# EAGLE design xe-lvl (EAGLE 9.5.0)

## Sheet 1 of 4: BUS i/o
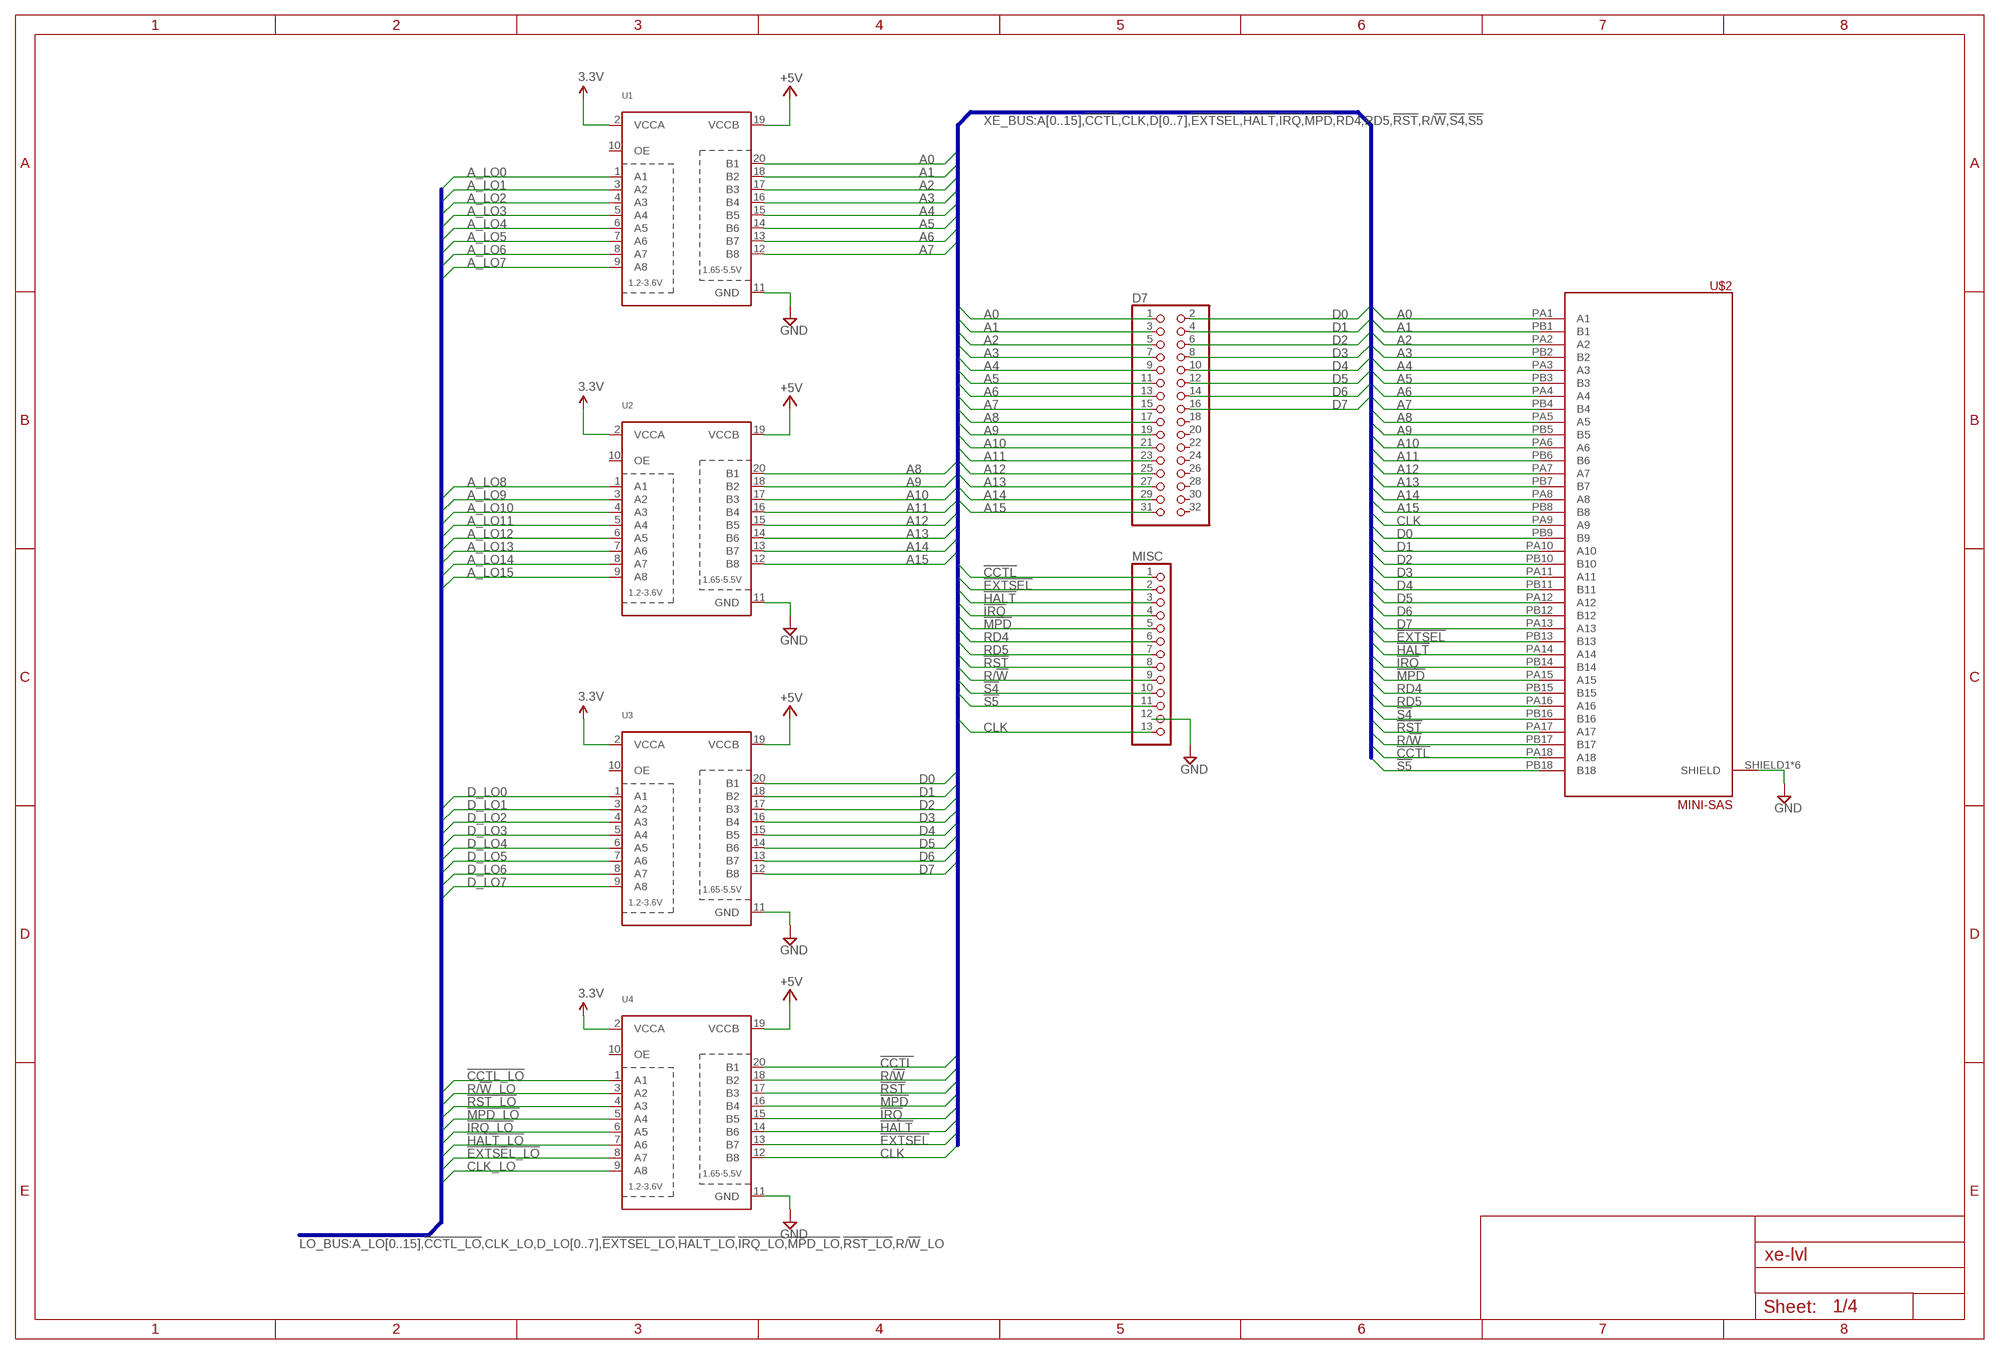
[diagram p0: schematic, sheet 1]

### Parts
D7  PINHD-2X16  [2X16]
MISC  PINHD-1X13  [1X13]
U1  TXB0108PWR  [TSSOP20]
U2  TXB0108PWR  [TSSOP20]
U3  TXB0108PWR  [TSSOP20]
U4  TXB0108PWR  [TSSOP20]
U$2  MINI-SAS  [MINI-SAS]

### Nets
3.3V: U1.2(VCCA) U2.2(VCCA) U3.2(VCCA) U4.2(VCCA) ; also sheet 4
!CCTL!: MISC.1 U4.20(B1) U$2.PA18(A18)
!CCTL_LO!: U4.1(A1)
!EXTSEL!: MISC.2 U4.13(B7) U$2.PB13(B13)
!EXTSEL_LO!: U4.8(A7)
!HALT!: MISC.3 U4.14(B6) U$2.PA14(A14)
!HALT_LO!: U4.7(A6)
!IRQ!: MISC.4 U4.15(B5) U$2.PB14(B14)
!IRQ_LO!: U4.6(A5)
!MPD!: MISC.5 U4.16(B4) U$2.PA15(A15)
!MPD_LO!: U4.5(A4)
!RST!: MISC.8 U4.17(B3) U$2.PA17(A17) ; also sheet 4
!RST_LO!: U4.4(A3)
!S4!: MISC.10 U$2.PB16(B16)
!S5!: MISC.11 U$2.PB18(B18)
+5V: U1.19(VCCB) U2.19(VCCB) U3.19(VCCB) U4.19(VCCB) ; also sheet 4
A0: D7.1 U1.20(B1) U$2.PA1(A1)
A1: D7.3 U1.18(B2) U$2.PB1(B1)
A2: D7.5 U1.17(B3) U$2.PA2(A2)
A3: D7.7 U1.16(B4) U$2.PB2(B2)
A4: D7.9 U1.15(B5) U$2.PA3(A3)
A5: D7.11 U1.14(B6) U$2.PB3(B3)
A6: D7.13 U1.13(B7) U$2.PA4(A4)
A7: D7.15 U1.12(B8) U$2.PB4(B4)
A8: D7.17 U2.20(B1) U$2.PA5(A5)
A9: D7.19 U2.18(B2) U$2.PB5(B5)
A10: D7.21 U2.17(B3) U$2.PA6(A6)
A11: D7.23 U2.16(B4) U$2.PB6(B6)
A12: D7.25 U2.15(B5) U$2.PA7(A7)
A13: D7.27 U2.14(B6) U$2.PB7(B7)
A14: D7.29 U2.13(B7) U$2.PA8(A8)
A15: D7.31 U2.12(B8) U$2.PB8(B8)
A_LO0: U1.1(A1)
A_LO1: U1.3(A2)
A_LO2: U1.4(A3)
A_LO3: U1.5(A4)
A_LO4: U1.6(A5)
A_LO5: U1.7(A6)
A_LO6: U1.8(A7)
A_LO7: U1.9(A8)
A_LO8: U2.1(A1)
A_LO9: U2.3(A2)
A_LO10: U2.4(A3)
A_LO11: U2.5(A4)
A_LO12: U2.6(A5)
A_LO13: U2.7(A6)
A_LO14: U2.8(A7)
A_LO15: U2.9(A8)
CLK: MISC.13 U4.12(B8) U$2.PA9(A9)
CLK_LO: U4.9(A8)
D0: D7.2 U3.20(B1) U$2.PB9(B9)
D1: D7.4 U3.18(B2) U$2.PA10(A10)
D2: D7.6 U3.17(B3) U$2.PB10(B10)
D3: D7.8 U3.16(B4) U$2.PA11(A11)
D4: D7.10 U3.15(B5) U$2.PB11(B11)
D5: D7.12 U3.14(B6) U$2.PA12(A12)
D6: D7.14 U3.13(B7) U$2.PB12(B12)
D7: D7.16 U3.12(B8) U$2.PA13(A13)
D_LO0: U3.1(A1)
D_LO1: U3.3(A2)
D_LO2: U3.4(A3)
D_LO3: U3.5(A4)
D_LO4: U3.6(A5)
D_LO5: U3.7(A6)
D_LO6: U3.8(A7)
D_LO7: U3.9(A8)
GND: MISC.12 U1.11(GND) U2.11(GND) U3.11(GND) U4.11(GND) U$2.SHIELD1(SHIELD) U$2.SHIELD2(SHIELD) U$2.SHIELD3(SHIELD) U$2.SHIELD4(SHIELD) U$2.SHIELD5(SHIELD) U$2.SHIELD6(SHIELD) ; also sheet 3,4
R/!W!: MISC.9 U4.18(B2) U$2.PB17(B17)
R/!W!_LO: U4.3(A2)
RD4: MISC.6 U$2.PB15(B15)
RD5: MISC.7 U$2.PA16(A16)
Unconnected: D7.18 D7.20 D7.22 D7.24 D7.26 D7.28 D7.30 D7.32 U1.10(OE) U2.10(OE) U3.10(OE) U4.10(OE)

### Buses
XE_BUS:A[0..15],!CCTL!,CLK,D[0..7],!EXTSEL!,!HALT!,!IRQ!,!MPD!,RD4,RD5,!RST!,R/!W!,!S4!,!S5!
LO_BUS:A_LO[0..15],!CCTL_LO!,CLK_LO,D_LO[0..7],!EXTSEL_LO!,!HALT_LO!,!IRQ_LO!,!MPD_LO!,!RST_LO!,R/!W!_LO

## Sheet 2 of 4
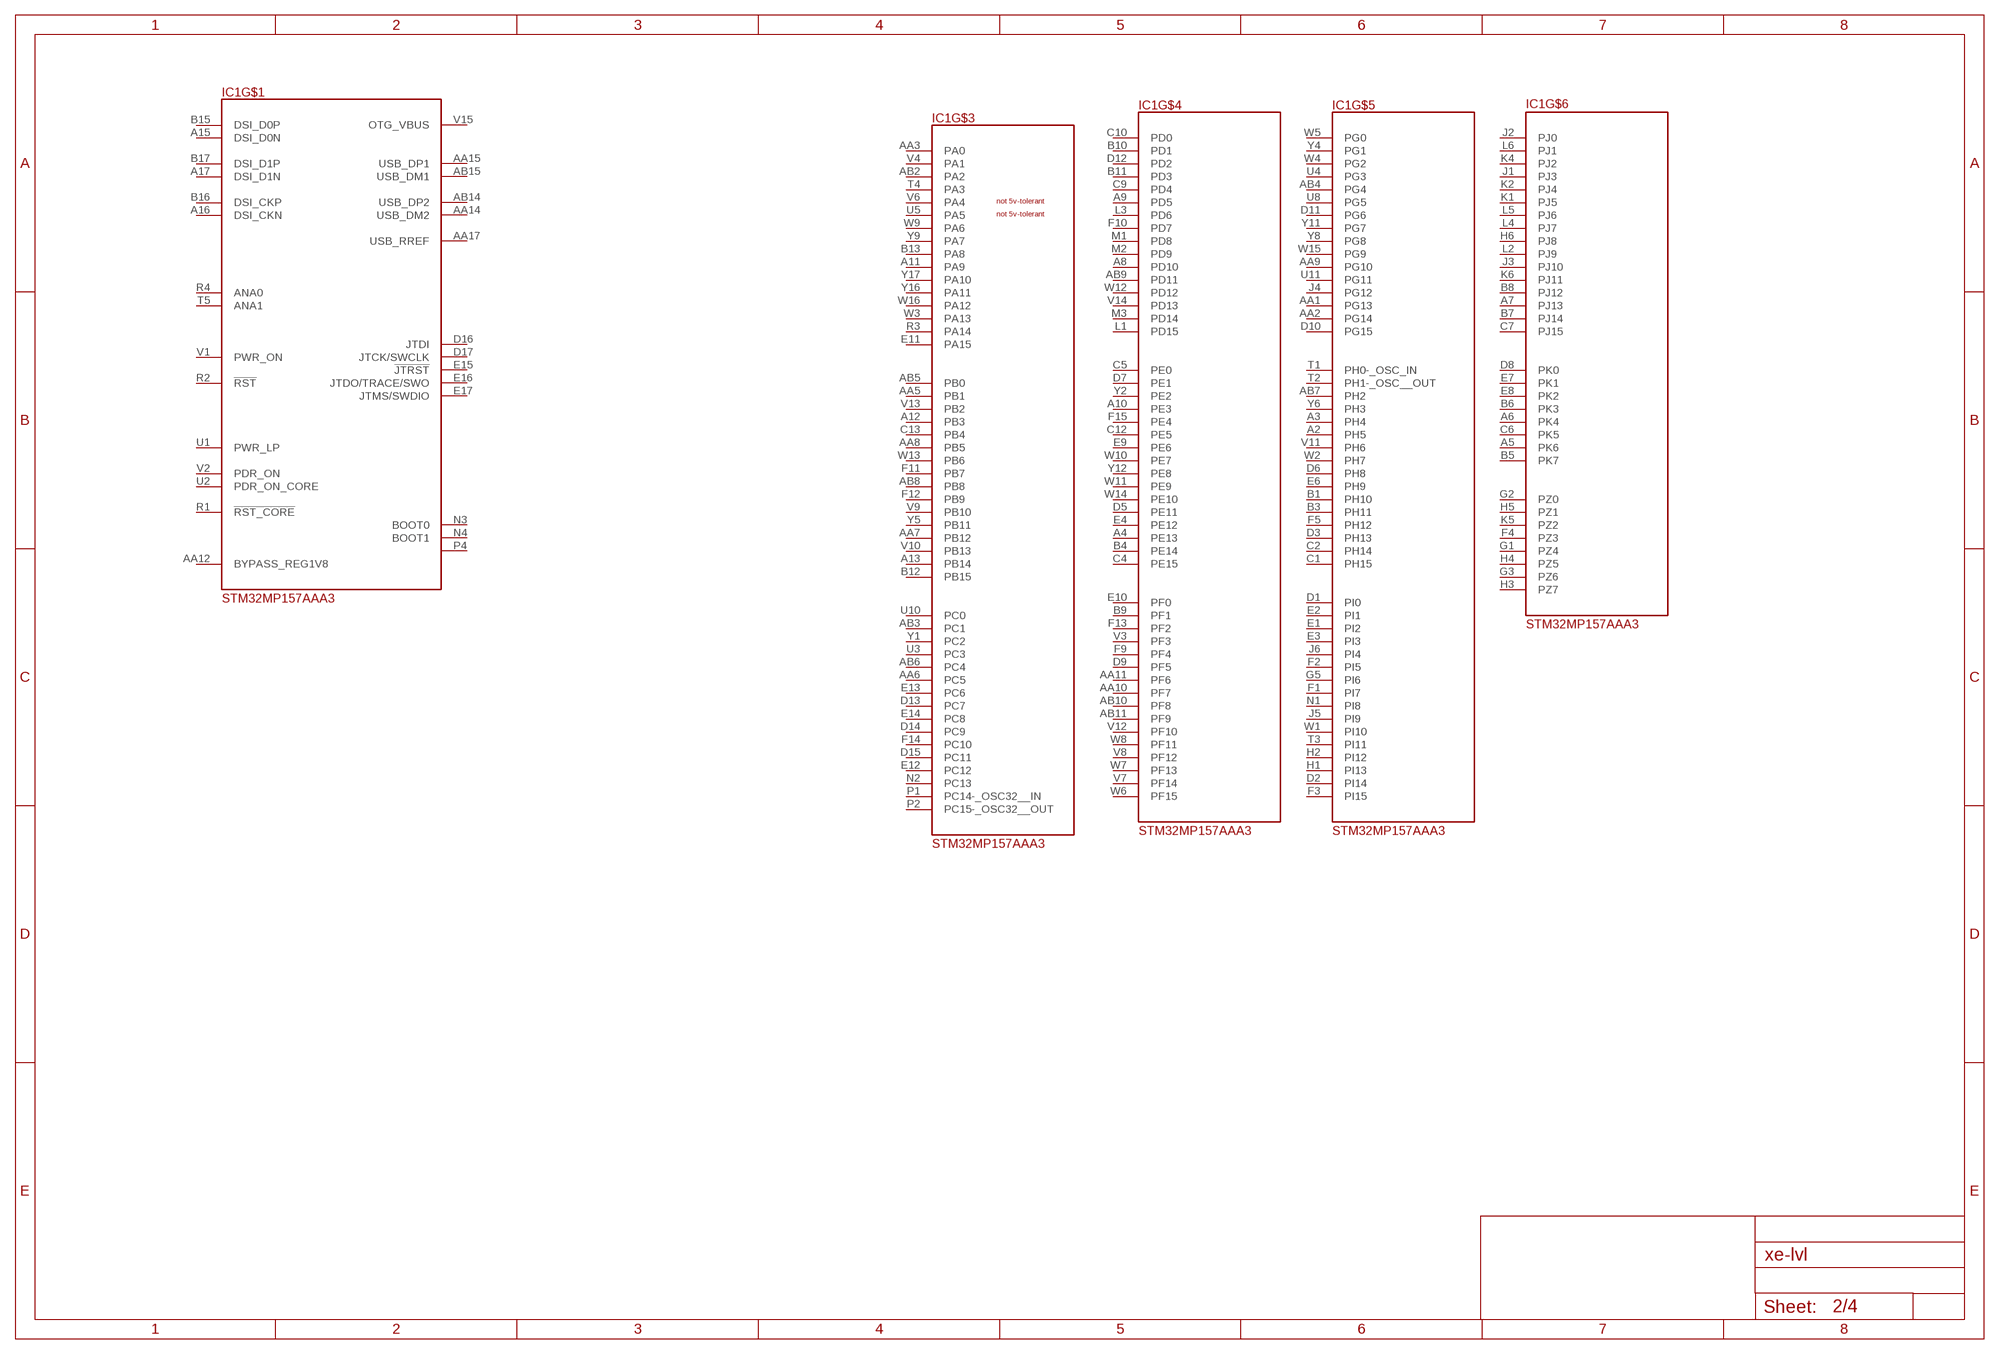
[diagram p1: schematic, sheet 2]

### Parts
IC1  STM32MP157AAA3  [BGA448C80P22X22_1800X1800X127]
Unconnected: IC1.A2(PH5) IC1.A3(PH4) IC1.A4(PE13) IC1.A5(PK6) IC1.A6(PK4) IC1.A7(PJ13) IC1.A8(PD10) IC1.A9(PD5) IC1.A10(PE3) IC1.A11(PA9) IC1.A12(PB3) IC1.A13(PB14) IC1.A15(DSI_D0N) IC1.A16(DSI_CKN) IC1.A17(DSI_D1N) IC1.AA1(PG13) IC1.AA2(PG14) IC1.AA3(PA0) IC1.AA5(PB1) IC1.AA6(PC5) IC1.AA7(PB12) IC1.AA8(PB5) IC1.AA9(PG10) IC1.AA10(PF7) IC1.AA11(PF6) IC1.AA12(BYPASS_REG1V8) IC1.AA14(USB_DM2) IC1.AA15(USB_DP1) IC1.AA17(USB_RREF) IC1.AB2(PA2) IC1.AB3(PC1) IC1.AB4(PG4) IC1.AB5(PB0) IC1.AB6(PC4) IC1.AB7(PH2) IC1.AB8(PB8) IC1.AB9(PD11) IC1.AB10(PF8) IC1.AB11(PF9) IC1.AB14(USB_DP2) IC1.AB15(USB_DM1) IC1.B1(PH10) IC1.B3(PH11) IC1.B4(PE14) IC1.B5(PK7) IC1.B6(PK3) IC1.B7(PJ14) IC1.B8(PJ12) IC1.B9(PF1) IC1.B10(PD1) IC1.B11(PD3) IC1.B12(PB15) IC1.B13(PA8) IC1.B15(DSI_D0P) IC1.B16(DSI_CKP) IC1.B17(DSI_D1P) IC1.C1(PH15) IC1.C2(PH14) IC1.C4(PE15) IC1.C5(PE0) IC1.C6(PK5) IC1.C7(PJ15) IC1.C9(PD4) IC1.C10(PD0) IC1.C12(PE5) IC1.C13(PB4) IC1.D1(PI0) IC1.D2(PI14) IC1.D3(PH13) IC1.D5(PE11) IC1.D6(PH8) IC1.D7(PE1) IC1.D8(PK0) IC1.D9(PF5) IC1.D10(PG15) IC1.D11(PG6) IC1.D12(PD2) IC1.D13(PC7) IC1.D14(PC9) IC1.D15(PC11) IC1.D16(JTDI) IC1.D17(JTCK/SWCLK) IC1.E1(PI2) IC1.E2(PI1) IC1.E3(PI3) IC1.E4(PE12) IC1.E6(PH9) IC1.E7(PK1) IC1.E8(PK2) IC1.E9(PE6) IC1.E10(PF0) IC1.E11(PA15) IC1.E12(PC12) IC1.E13(PC6) IC1.E14(PC8) IC1.E15(!JTRST) IC1.E16(JTDO/TRACE/SWO) IC1.E17(JTMS/SWDIO) IC1.F1(PI7) IC1.F2(PI5) IC1.F3(PI15) IC1.F4(PZ3) IC1.F5(PH12) IC1.F9(PF4) IC1.F10(PD7) IC1.F11(PB7) IC1.F12(PB9) IC1.F13(PF2) IC1.F14(PC10) IC1.F15(PE4) IC1.G1(PZ4) IC1.G2(PZ0) IC1.G3(PZ6) IC1.G5(PI6) IC1.H1(PI13) IC1.H2(PI12) IC1.H3(PZ7) IC1.H4(PZ5) IC1.H5(PZ1) IC1.H6(PJ8) IC1.J1(PJ3) IC1.J2(PJ0) IC1.J3(PJ10) IC1.J4(PG12) IC1.J5(PI9) IC1.J6(PI4) IC1.K1(PJ5) IC1.K2(PJ4) IC1.K4(PJ2) IC1.K5(PZ2) IC1.K6(PJ11) IC1.L1(PD15) IC1.L2(PJ9) IC1.L3(PD6) IC1.L4(PJ7) IC1.L5(PJ6) IC1.L6(PJ1) IC1.M1(PD8) IC1.M2(PD9) IC1.M3(PD14) IC1.N1(PI8) IC1.N2(PC13) IC1.N3(BOOT0) IC1.N4(BOOT1) IC1.P1(PC14-_OSC32__IN) IC1.P2(PC15-_OSC32__OUT) IC1.P4 IC1.R1(!RST_CORE!) IC1.R2(!RST!) IC1.R3(PA14) IC1.R4(ANA0) IC1.T1(PH0-_OSC_IN) IC1.T2(PH1-_OSC__OUT) IC1.T3(PI11) IC1.T4(PA3) IC1.T5(ANA1) IC1.U1(PWR_LP) IC1.U2(PDR_ON_CORE) IC1.U3(PC3) IC1.U4(PG3) IC1.U5(PA5) IC1.U8(PG5) IC1.U10(PC0) IC1.U11(PG11) IC1.V1(PWR_ON) IC1.V2(PDR_ON) IC1.V3(PF3) IC1.V4(PA1) IC1.V6(PA4) IC1.V7(PF14) IC1.V8(PF12) IC1.V9(PB10) IC1.V10(PB13) IC1.V11(PH6) IC1.V12(PF10) IC1.V13(PB2) IC1.V14(PD13) IC1.V15(OTG_VBUS) IC1.W1(PI10) IC1.W2(PH7) IC1.W3(PA13) IC1.W4(PG2) IC1.W5(PG0) IC1.W6(PF15) IC1.W7(PF13) IC1.W8(PF11) IC1.W9(PA6) IC1.W10(PE7) IC1.W11(PE9) IC1.W12(PD12) IC1.W13(PB6) IC1.W14(PE10) IC1.W15(PG9) IC1.W16(PA12) IC1.Y1(PC2) IC1.Y2(PE2) IC1.Y4(PG1) IC1.Y5(PB11) IC1.Y6(PH3) IC1.Y8(PG8) IC1.Y9(PA7) IC1.Y11(PG7) IC1.Y12(PE8) IC1.Y16(PA11) IC1.Y17(PA10)

## Sheet 3 of 4: Memory
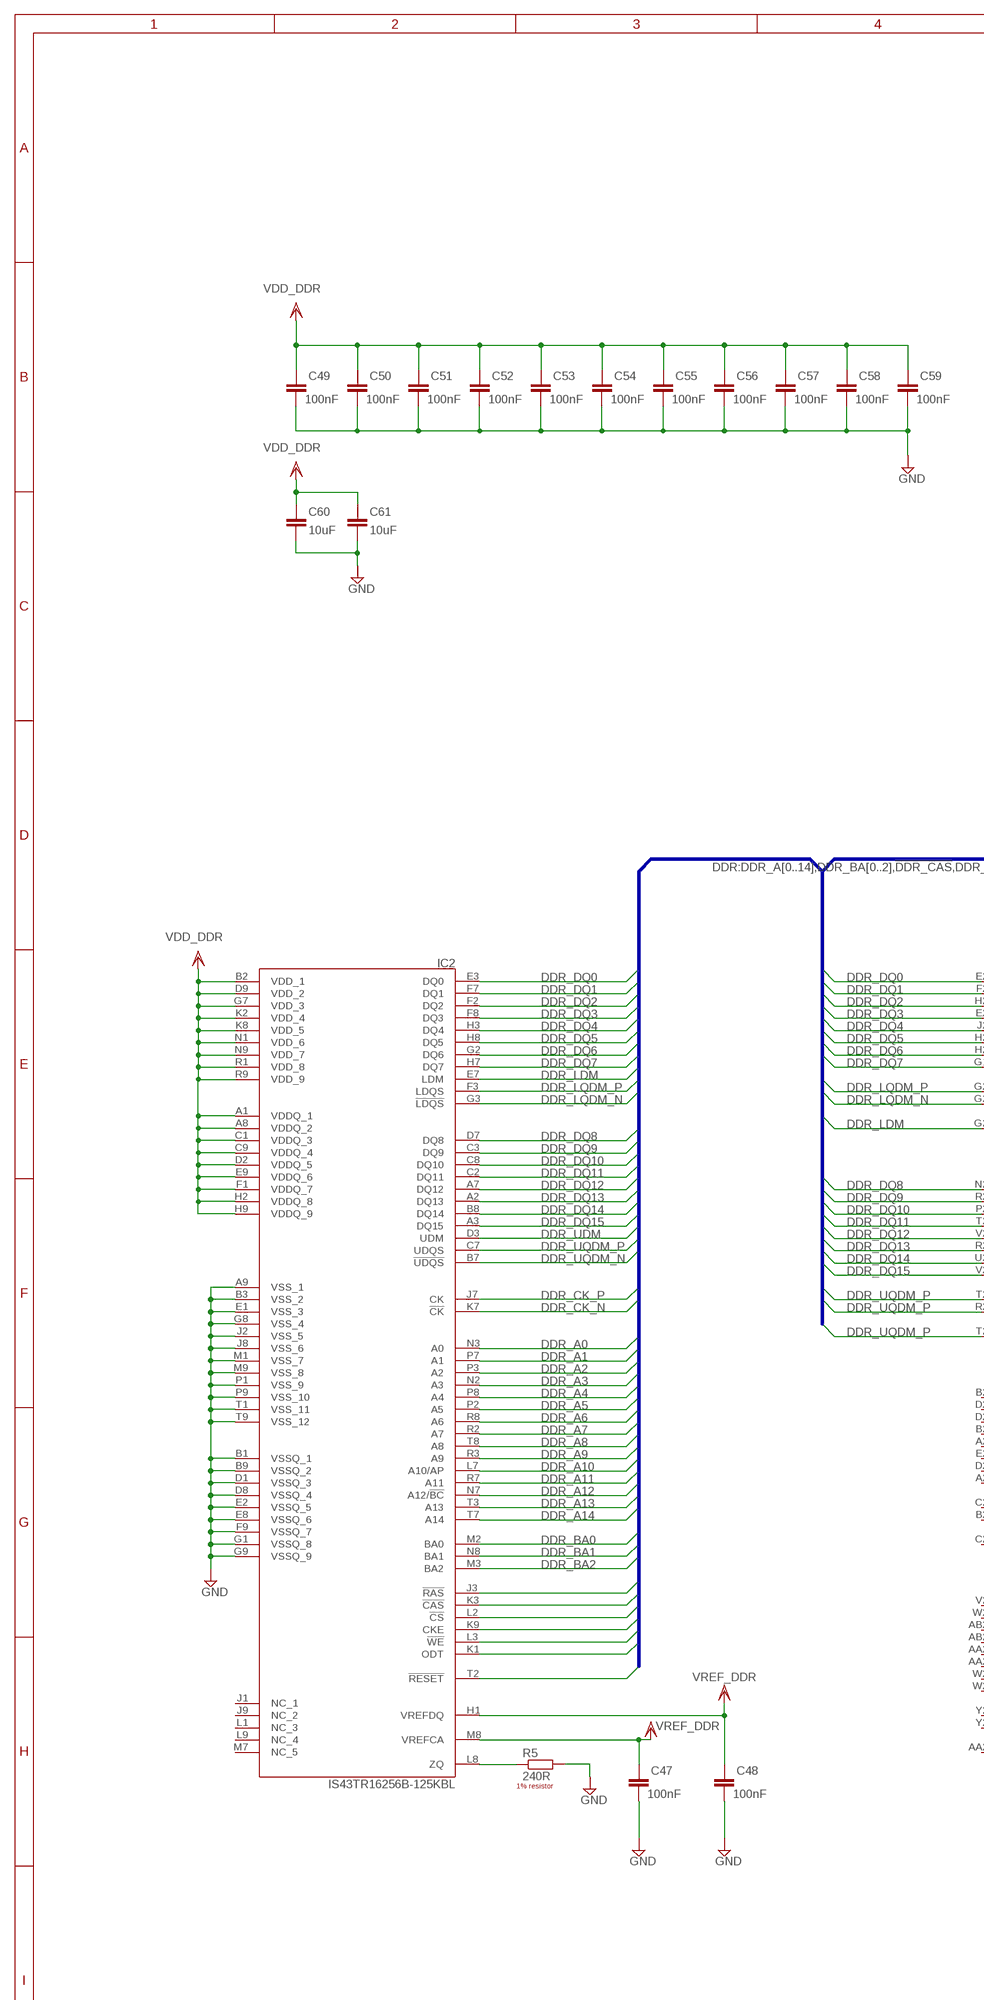
[diagram p2: schematic, sheet 3, part 1 of 2]
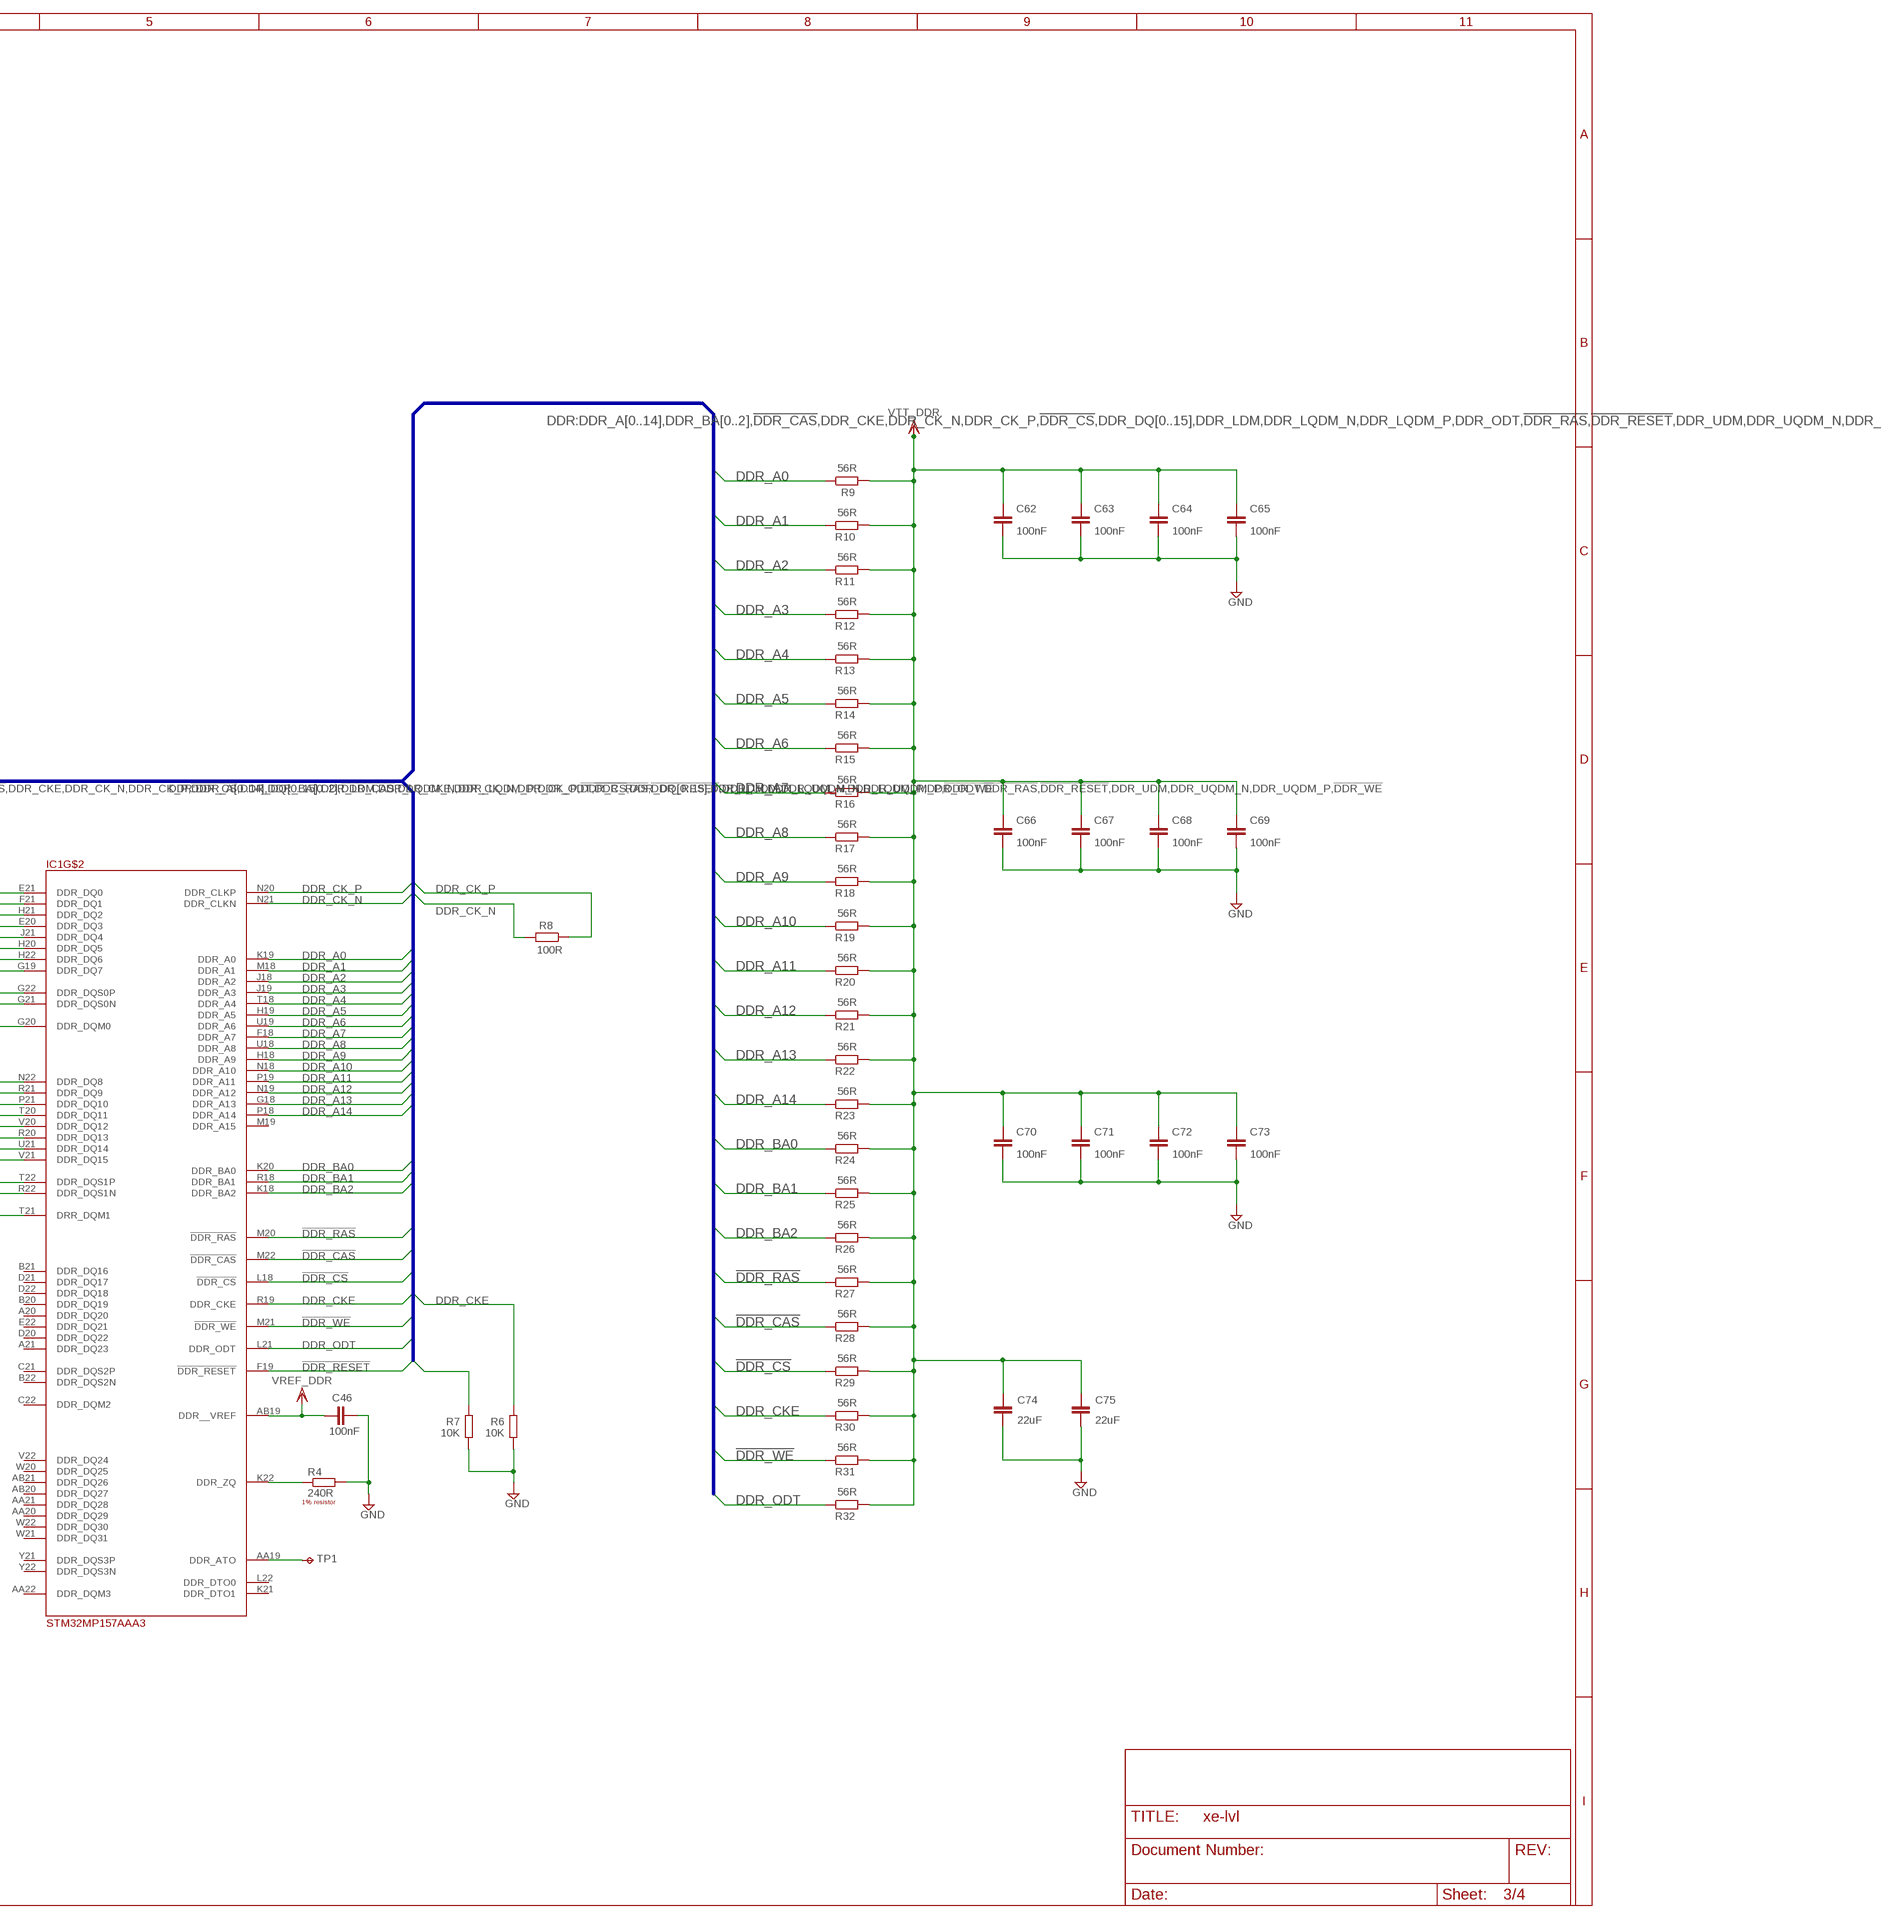
[diagram p3: schematic, sheet 3, part 2 of 2]

### Parts
C46  100nF  C-EUC0201  [C0201]
C47  100nF  C-EUC0201  [C0201]
C48  100nF  C-EUC0201  [C0201]
C49  100nF  C-EUC0201  [C0201]
C50  100nF  C-EUC0201  [C0201]
C51  100nF  C-EUC0201  [C0201]
C52  100nF  C-EUC0201  [C0201]
C53  100nF  C-EUC0201  [C0201]
C54  100nF  C-EUC0201  [C0201]
C55  100nF  C-EUC0201  [C0201]
C56  100nF  C-EUC0201  [C0201]
C57  100nF  C-EUC0201  [C0201]
C58  100nF  C-EUC0201  [C0201]
C59  100nF  C-EUC0201  [C0201]
C60  10uF  C-EUC0402  [C0402]
C61  10uF  C-EUC0402  [C0402]
C62  100nF  C-EUC0201  [C0201]
C63  100nF  C-EUC0201  [C0201]
C64  100nF  C-EUC0201  [C0201]
C65  100nF  C-EUC0201  [C0201]
C66  100nF  C-EUC0201  [C0201]
C67  100nF  C-EUC0201  [C0201]
C68  100nF  C-EUC0201  [C0201]
C69  100nF  C-EUC0201  [C0201]
C70  100nF  C-EUC0201  [C0201]
C71  100nF  C-EUC0201  [C0201]
C72  100nF  C-EUC0201  [C0201]
C73  100nF  C-EUC0201  [C0201]
C74  22uF  C-EUC0402  [C0402]
C75  22uF  C-EUC0402  [C0402]
IC2  IS43TR16256B-125KBL  MT41K256M16TW-107_P  [BGA96C80P9X16_800X1400X120]
R4  240R  R-EU_R0201  [R0201]
R5  240R  R-EU_R0201  [R0201]
R6  10K  R-EU_R0201  [R0201]
R7  10K  R-EU_R0201  [R0201]
R8  100R  R-EU_R0201  [R0201]
R9  56R  R-EU_R0201  [R0201]
R10  56R  R-EU_R0201  [R0201]
R11  56R  R-EU_R0201  [R0201]
R12  56R  R-EU_R0201  [R0201]
R13  56R  R-EU_R0201  [R0201]
R14  56R  R-EU_R0201  [R0201]
R15  56R  R-EU_R0201  [R0201]
R16  56R  R-EU_R0201  [R0201]
R17  56R  R-EU_R0201  [R0201]
R18  56R  R-EU_R0201  [R0201]
R19  56R  R-EU_R0201  [R0201]
R20  56R  R-EU_R0201  [R0201]
R21  56R  R-EU_R0201  [R0201]
R22  56R  R-EU_R0201  [R0201]
R23  56R  R-EU_R0201  [R0201]
R24  56R  R-EU_R0201  [R0201]
R25  56R  R-EU_R0201  [R0201]
R26  56R  R-EU_R0201  [R0201]
R27  56R  R-EU_R0201  [R0201]
R28  56R  R-EU_R0201  [R0201]
R29  56R  R-EU_R0201  [R0201]
R30  56R  R-EU_R0201  [R0201]
R31  56R  R-EU_R0201  [R0201]
R32  56R  R-EU_R0201  [R0201]
TP1  TPB1,27  [B1,27]

### Nets
!DDR_CAS! [DDR_CTRL]: IC1.M22(!DDR_CAS!) IC2.K3(!CAS!) R28.1
!DDR_CS! [DDR_CTRL]: IC1.L18(!DDR_CS!) IC2.L2(!CS!) R29.1
!DDR_RAS! [DDR_CTRL]: IC1.M20(!DDR_RAS!) IC2.J3(!RAS!) R27.1
!DDR_RESET!: IC1.F19(!DDR_RESET!) IC2.T2(!RESET!) R7.2
!DDR_WE! [DDR_CTRL]: IC1.M21(!DDR_WE!) IC2.L3(!WE!) R31.1
DDR_A0 [DDR_CTRL]: IC1.K19(DDR_A0) IC2.N3(A0) R9.1
DDR_A1 [DDR_CTRL]: IC1.M18(DDR_A1) IC2.P7(A1) R10.1
DDR_A2 [DDR_CTRL]: IC1.J18(DDR_A2) IC2.P3(A2) R11.1
DDR_A3 [DDR_CTRL]: IC1.J19(DDR_A3) IC2.N2(A3) R12.1
DDR_A4 [DDR_CTRL]: IC1.T18(DDR_A4) IC2.P8(A4) R13.1
DDR_A5 [DDR_CTRL]: IC1.H19(DDR_A5) IC2.P2(A5) R14.1
DDR_A6 [DDR_CTRL]: IC1.U19(DDR_A6) IC2.R8(A6) R15.1
DDR_A7 [DDR_CTRL]: IC1.F18(DDR_A7) IC2.R2(A7) R16.1
DDR_A8 [DDR_CTRL]: IC1.U18(DDR_A8) IC2.T8(A8) R17.1
DDR_A9 [DDR_CTRL]: IC1.H18(DDR_A9) IC2.R3(A9) R18.1
DDR_A10 [DDR_CTRL]: IC1.N18(DDR_A10) IC2.L7(A10/AP) R19.1
DDR_A11 [DDR_CTRL]: IC1.P19(DDR_A11) IC2.R7(A11) R20.1
DDR_A12 [DDR_CTRL]: IC1.N19(DDR_A12) IC2.N7(A12/!BC!) R21.1
DDR_A13 [DDR_CTRL]: IC1.G18(DDR_A13) IC2.T3(A13) R22.1
DDR_A14 [DDR_CTRL]: IC1.P18(DDR_A14) IC2.T7(A14) R23.1
DDR_BA0 [DDR_CTRL]: IC1.K20(DDR_BA0) IC2.M2(BA0) R24.1
DDR_BA1 [DDR_CTRL]: IC1.R18(DDR_BA1) IC2.N8(BA1) R25.1
DDR_BA2 [DDR_CTRL]: IC1.K18(DDR_BA2) IC2.M3(BA2) R26.1
DDR_CK_N [DDR_CK]: IC1.N21(DDR_CLKN) IC2.K7(!CK!) R8.2
DDR_CK_P [DDR_CK]: IC1.N20(DDR_CLKP) IC2.J7(CK) R8.1
DDR_CKE [DDR_CTRL]: IC1.R19(DDR_CKE) IC2.K9(CKE) R6.2 R30.1
DDR_DQ0 [DDR_DQ]: IC1.E21(DDR_DQ0) IC2.E3(DQ0)
DDR_DQ1 [DDR_DQ]: IC1.F21(DDR_DQ1) IC2.F7(DQ1)
DDR_DQ2 [DDR_DQ]: IC1.H21(DDR_DQ2) IC2.F2(DQ2)
DDR_DQ3 [DDR_DQ]: IC1.E20(DDR_DQ3) IC2.F8(DQ3)
DDR_DQ4 [DDR_DQ]: IC1.J21(DDR_DQ4) IC2.H3(DQ4)
DDR_DQ5 [DDR_DQ]: IC1.H20(DDR_DQ5) IC2.H8(DQ5)
DDR_DQ6 [DDR_DQ]: IC1.H22(DDR_DQ6) IC2.G2(DQ6)
DDR_DQ7 [DDR_DQ]: IC1.G19(DDR_DQ7) IC2.H7(DQ7)
DDR_DQ8 [DDR_DQ]: IC1.N22(DDR_DQ8) IC2.D7(DQ8)
DDR_DQ9 [DDR_DQ]: IC1.R21(DDR_DQ9) IC2.C3(DQ9)
DDR_DQ10 [DDR_DQ]: IC1.P21(DDR_DQ10) IC2.C8(DQ10)
DDR_DQ11 [DDR_DQ]: IC1.T20(DDR_DQ11) IC2.C2(DQ11)
DDR_DQ12 [DDR_DQ]: IC1.V20(DDR_DQ12) IC2.A7(DQ12)
DDR_DQ13 [DDR_DQ]: IC1.R20(DDR_DQ13) IC2.A2(DQ13)
DDR_DQ14 [DDR_DQ]: IC1.U21(DDR_DQ14) IC2.B8(DQ14)
DDR_DQ15 [DDR_DQ]: IC1.V21(DDR_DQ15) IC2.A3(DQ15)
DDR_LDM [DDR_DQ]: IC1.G20(DDR_DQM0) IC2.E7(LDM)
DDR_LQDM_N [DDR_DQ]: IC1.G21(DDR_DQS0N) IC2.G3(!LDQS!)
DDR_LQDM_P [DDR_DQ]: IC1.G22(DDR_DQS0P) IC2.F3(LDQS)
DDR_ODT [DDR_CTRL]: IC1.L21(DDR_ODT) IC2.K1(ODT) R32.1
DDR_UDM [DDR_DQ]: IC1.T21(DRR_DQM1) IC2.D3(UDM)
DDR_UQDM_N [DDR_DQ]: IC1.R22(DDR_DQS1N) IC2.B7(!UDQS!)
DDR_UQDM_P [DDR_DQ]: IC1.T22(DDR_DQS1P) IC2.C7(UDQS)
GND: C46.2 C47.1 C48.1 C49.1 C50.1 C51.1 C52.1 C53.1 C54.1 C55.1 C56.1 C57.1 C58.1 C59.1 C60.2 C61.2 C62.1 C63.1 C64.1 C65.1 C66.1 C67.1 C68.1 C69.1 C70.1 C71.1 C72.1 C73.1 C74.1 C75.1 IC2.A9(VSS_1) IC2.B1(VSSQ_1) IC2.B3(VSS_2) IC2.B9(VSSQ_2) IC2.D1(VSSQ_3) IC2.D8(VSSQ_4) IC2.E1(VSS_3) IC2.E2(VSSQ_5) IC2.E8(VSSQ_6) IC2.F9(VSSQ_7) IC2.G1(VSSQ_8) IC2.G8(VSS_4) IC2.G9(VSSQ_9) IC2.J2(VSS_5) IC2.J8(VSS_6) IC2.M1(VSS_7) IC2.M9(VSS_8) IC2.P1(VSS_9) IC2.P9(VSS_10) IC2.T1(VSS_11) IC2.T9(VSS_12) R4.2 R5.2 R6.1 R7.1 ; also sheet 1,4
N$15: IC1.K22(DDR_ZQ) R4.1
N$16: IC1.AA19(DDR_ATO) TP1.TP
N$17: IC2.L8(ZQ) R5.1
VDD_DDR: C49.2 C50.2 C51.2 C52.2 C53.2 C54.2 C55.2 C56.2 C57.2 C58.2 C59.2 C60.1 C61.1 IC2.A1(VDDQ_1) IC2.A8(VDDQ_2) IC2.B2(VDD_1) IC2.C1(VDDQ_3) IC2.C9(VDDQ_4) IC2.D2(VDDQ_5) IC2.D9(VDD_2) IC2.E9(VDDQ_6) IC2.F1(VDDQ_7) IC2.G7(VDD_3) IC2.H2(VDDQ_8) IC2.H9(VDDQ_9) IC2.K2(VDD_4) IC2.K8(VDD_5) IC2.N1(VDD_6) IC2.N9(VDD_7) IC2.R1(VDD_8) IC2.R9(VDD_9) ; also sheet 4
VREF_DDR: C46.1 C47.2 C48.2 IC1.AB19(DDR__VREF) IC2.H1(VREFDQ) IC2.M8(VREFCA) ; also sheet 4
VTT_DDR: C62.2 C63.2 C64.2 C65.2 C66.2 C67.2 C68.2 C69.2 C70.2 C71.2 C72.2 C73.2 C74.2 C75.2 R9.2 R10.2 R11.2 R12.2 R13.2 R14.2 R15.2 R16.2 R17.2 R18.2 R19.2 R20.2 R21.2 R22.2 R23.2 R24.2 R25.2 R26.2 R27.2 R28.2 R29.2 R30.2 R31.2 R32.2 ; also sheet 4
Unconnected: IC1.A20(DDR_DQ20) IC1.A21(DDR_DQ23) IC1.AA20(DDR_DQ29) IC1.AA21(DDR_DQ28) IC1.AA22(DDR_DQM3) IC1.AB20(DDR_DQ27) IC1.AB21(DDR_DQ26) IC1.B20(DDR_DQ19) IC1.B21(DDR_DQ16) IC1.B22(DDR_DQS2N) IC1.C21(DDR_DQS2P) IC1.C22(DDR_DQM2) IC1.D20(DDR_DQ22) IC1.D21(DDR_DQ17) IC1.D22(DDR_DQ18) IC1.E22(DDR_DQ21) IC1.K21(DDR_DTO1) IC1.L22(DDR_DTO0) IC1.M19(DDR_A15) IC1.V22(DDR_DQ24) IC1.W20(DDR_DQ25) IC1.W21(DDR_DQ31) IC1.W22(DDR_DQ30) IC1.Y21(DDR_DQS3P) IC1.Y22(DDR_DQS3N) IC2.J1(NC_1) IC2.J9(NC_2) IC2.L1(NC_3) IC2.L9(NC_4) IC2.M7(NC_5)

### Buses
DDR:DDR_A[0..14],DDR_BA[0..2],!DDR_CAS!,DDR_CKE,DDR_CK_N,DDR_CK_P,!DDR_CS!,DDR_DQ[0..15],DDR_LDM,DDR_LQDM_N,DDR_LQDM_P,DDR_ODT,!DDR_RAS!,!DDR_RESET!,DDR_UDM,DDR_UQDM_N,DDR_UQDM_P,!DDR_WE!

### Notes on the sheet
- 1% resistor
- 1% resistor

## Sheet 4 of 4: STM Power
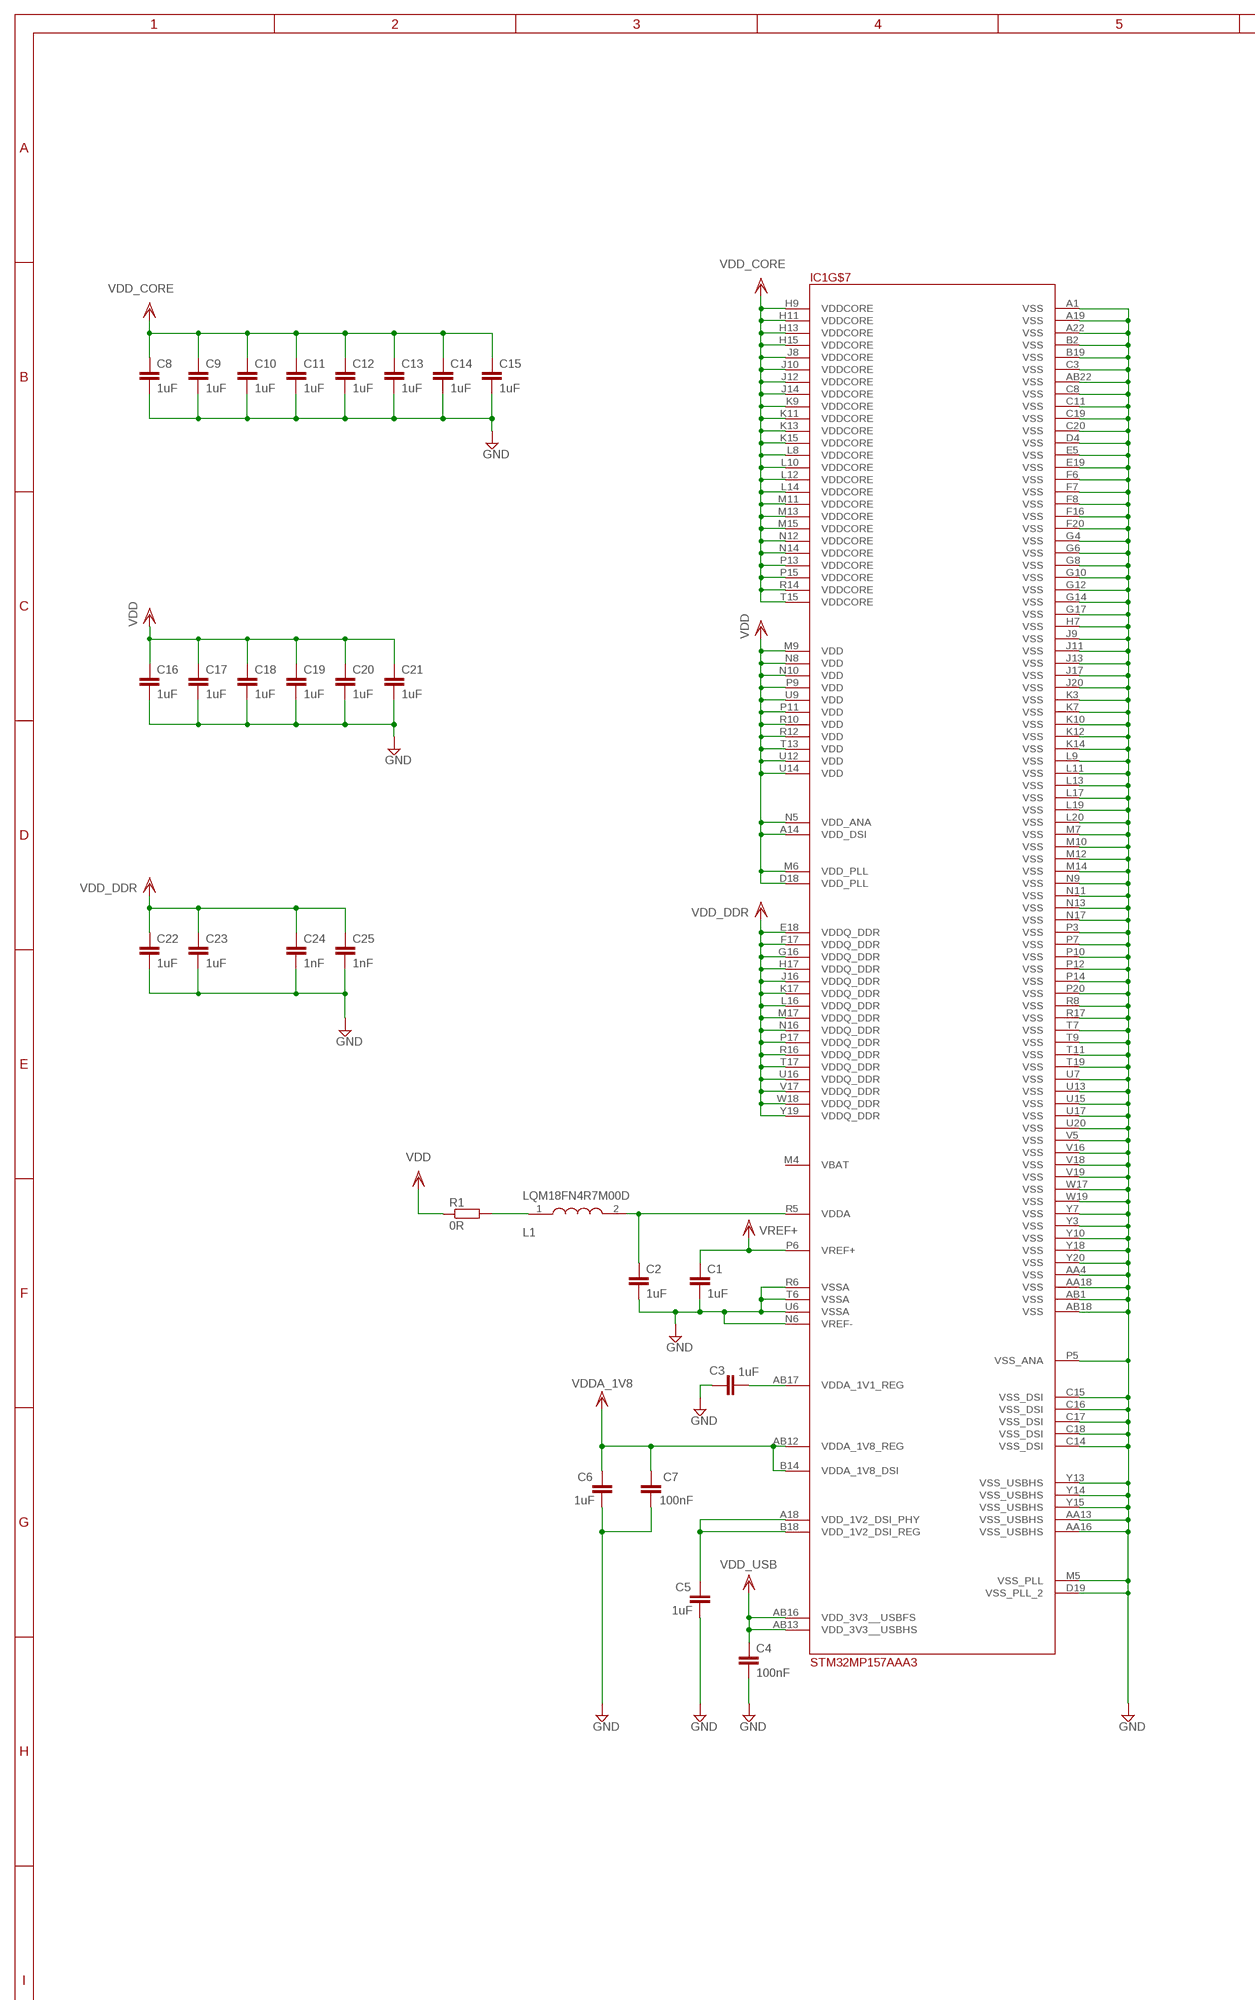
[diagram p4: schematic, sheet 4, part 1 of 2]
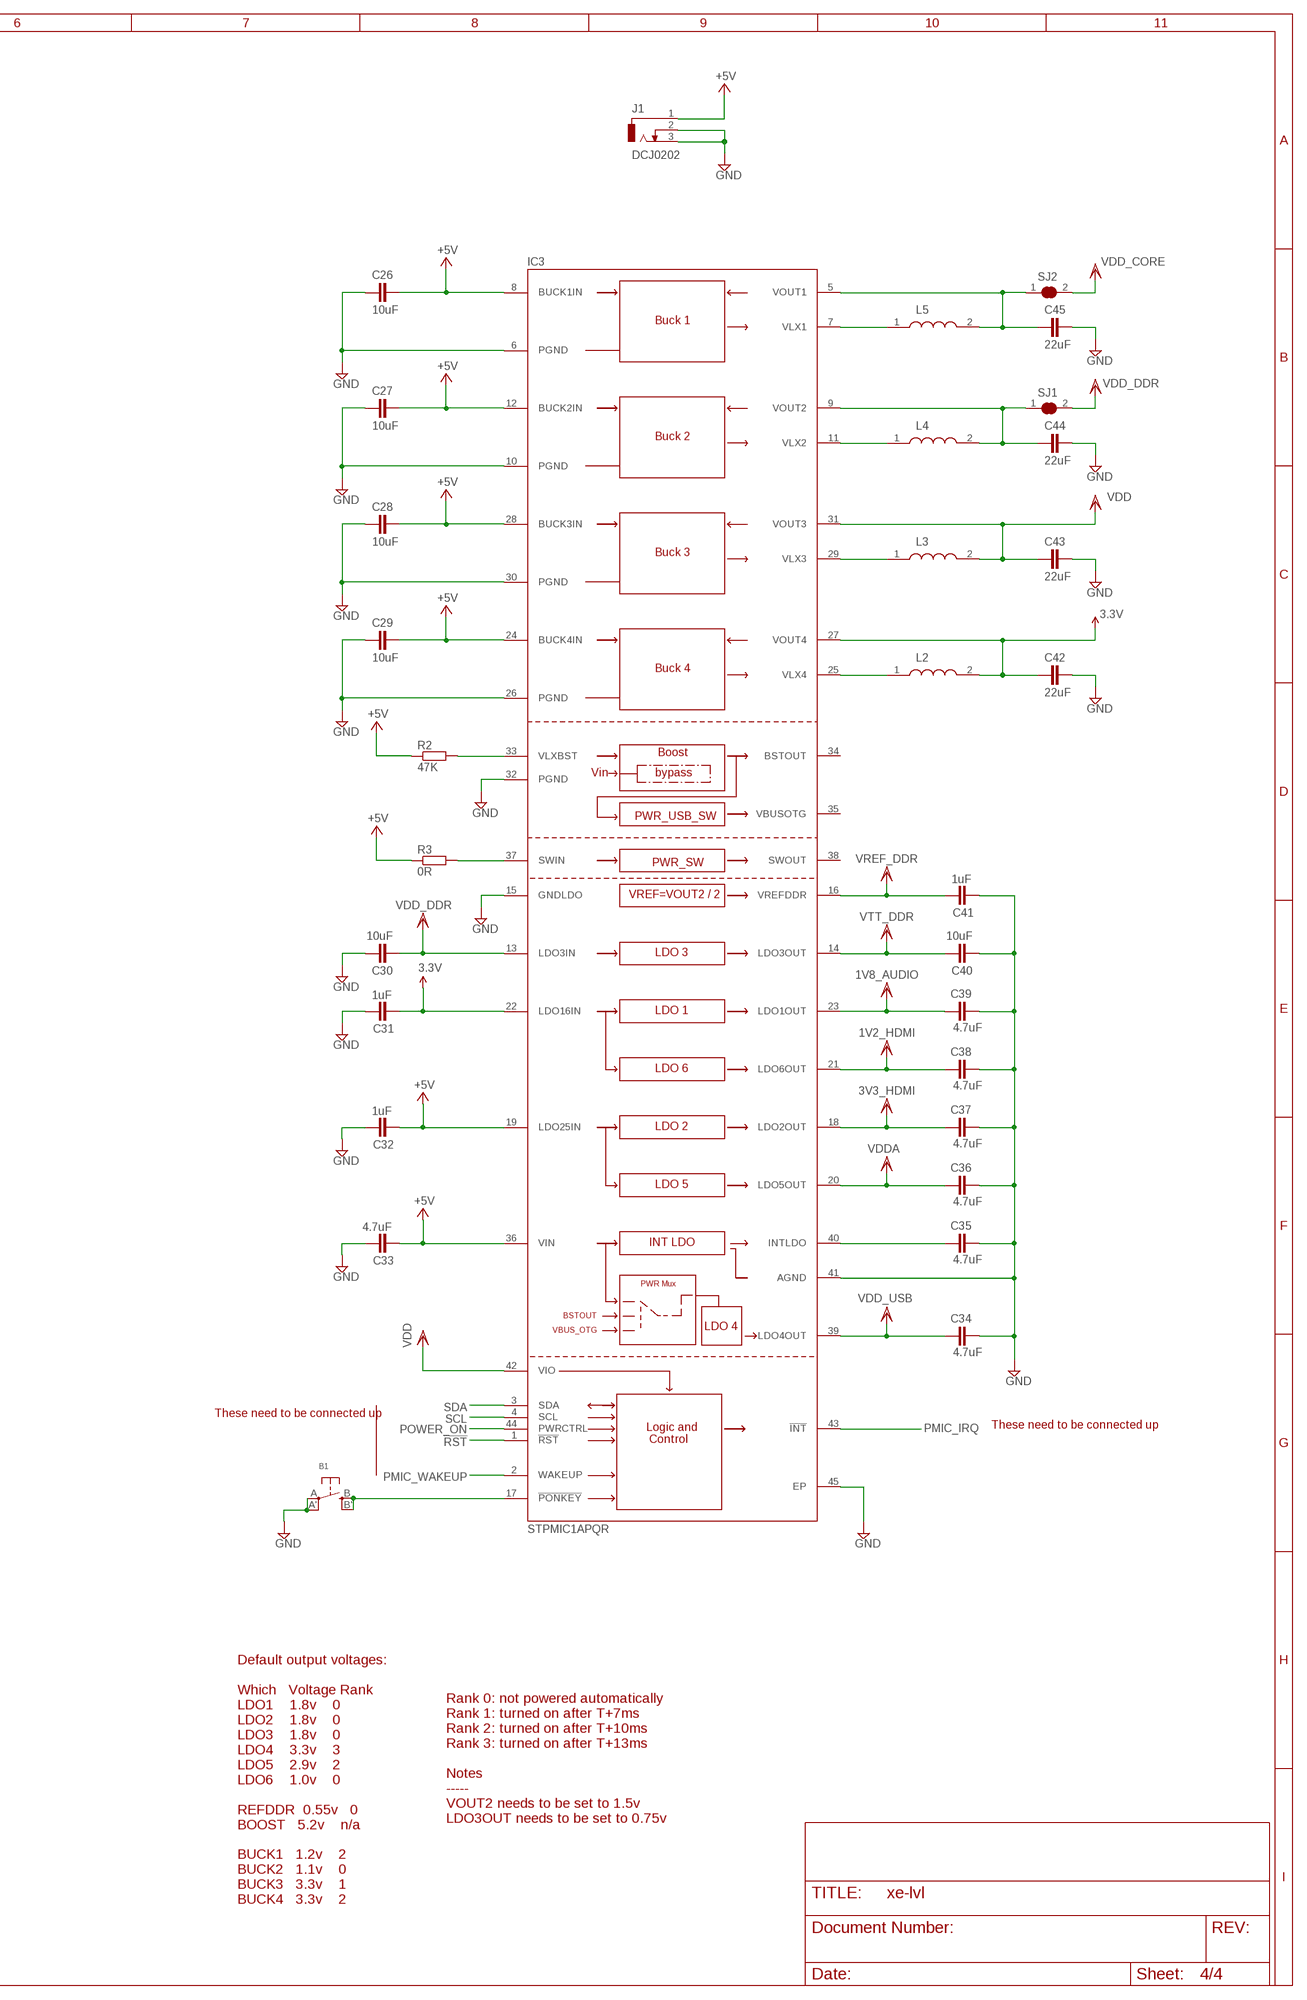
[diagram p5: schematic, sheet 4, part 2 of 2]

### Parts
B1  SWITCH_TACT_SMT  [EVQ-Q2]
C1  1uF  C-EUC0201  [C0201]
C2  1uF  C-EUC0201  [C0201]
C3  1uF  C-EUC0201  [C0201]
C4  100nF  C-EUC0201  [C0201]
C5  1uF  C-EUC0201  [C0201]
C6  1uF  C-EUC0201  [C0201]
C7  100nF  C-EUC0201  [C0201]
C8  1uF  C-EUC0201  [C0201]
C9  1uF  C-EUC0201  [C0201]
C10  1uF  C-EUC0201  [C0201]
C11  1uF  C-EUC0201  [C0201]
C12  1uF  C-EUC0201  [C0201]
C13  1uF  C-EUC0201  [C0201]
C14  1uF  C-EUC0201  [C0201]
C15  1uF  C-EUC0201  [C0201]
C16  1uF  C-EUC0201  [C0201]
C17  1uF  C-EUC0201  [C0201]
C18  1uF  C-EUC0201  [C0201]
C19  1uF  C-EUC0201  [C0201]
C20  1uF  C-EUC0201  [C0201]
C21  1uF  C-EUC0201  [C0201]
C22  1uF  C-EUC0201  [C0201]
C23  1uF  C-EUC0201  [C0201]
C24  1nF  C-EUC0201  [C0201]
C25  1nF  C-EUC0201  [C0201]
C26  10uF  C-EUC0402  [C0402]
C27  10uF  C-EUC0402  [C0402]
C28  10uF  C-EUC0402  [C0402]
C29  10uF  C-EUC0402  [C0402]
C30  10uF  C-EUC0402  [C0402]
C31  1uF  C-EUC0201  [C0201]
C32  1uF  C-EUC0201  [C0201]
C33  4.7uF  C-EUC0201  [C0201]
C34  4.7uF  C-EUC0201  [C0201]
C35  4.7uF  C-EUC0201  [C0201]
C36  4.7uF  C-EUC0201  [C0201]
C37  4.7uF  C-EUC0201  [C0201]
C38  4.7uF  C-EUC0201  [C0201]
C39  4.7uF  C-EUC0201  [C0201]
C40  10uF  C-EUC0402  [C0402]
C41  1uF  C-EUC0201  [C0201]
C42  22uF  C-EUC0402  [C0402]
C43  22uF  C-EUC0402  [C0402]
C44  22uF  C-EUC0402  [C0402]
C45  22uF  C-EUC0402  [C0402]
IC3  STPMIC1APQR  [QFN40P500X600X80-45N]
J1  DCJ0202  [DCJ0202]
L1  LQM18FN4R7M00D  [INDC1608X90N]
L2  DFE252012P-1ROM=P2  DFE252012P-4R7M=P2  [INDC2520X120N]
L3  DFE252012P-1ROM=P2  DFE252012P-4R7M=P2  [INDC2520X120N]
L4  DFE252012P-1ROM=P2  DFE252012P-4R7M=P2  [INDC2520X120N]
L5  DFE252012P-1ROM=P2  DFE252012P-4R7M=P2  [INDC2520X120N]
R1  0R  R-EU_R0201  [R0201]
R2  47K  R-EU_R0201  [R0201]
R3  0R  R-EU_R0201  [R0201]
SJ1  SOLDERJUMPER_CLOSEDPERM  [SOLDERJUMPER_CLOSEDPERM]
SJ2  SOLDERJUMPER_CLOSEDPERM  [SOLDERJUMPER_CLOSEDPERM]

### Nets
1V2_HDMI: C38.1 IC3.21(LDO6OUT)
1V8_AUDIO: C39.1 IC3.23(LDO1OUT)
3.3V: C31.1 C42.1 IC3.22(LDO16IN) IC3.27(VOUT4) L2.2 ; also sheet 1
3V3_HDMI: C37.1 IC3.18(LDO2OUT)
!RST!: IC3.1(!RST!) ; also sheet 1
+5V: C26.2 C27.2 C28.2 C29.2 C32.1 C33.1 IC3.8(BUCK1IN) IC3.12(BUCK2IN) IC3.19(LDO25IN) IC3.24(BUCK4IN) IC3.28(BUCK3IN) IC3.36(VIN) J1.1 R2.1 R3.1 ; also sheet 1
GND: B1.A'(P1) B1.A(P) C1.2 C2.2 C3.1 C4.2 C5.1 C6.1 C7.1 C8.2 C9.2 C10.2 C11.2 C12.2 C13.2 C14.2 C15.2 C16.2 C17.2 C18.2 C19.2 C20.2 C21.2 C22.2 C23.2 C24.2 C25.2 C26.1 C27.1 C28.1 C29.1 C30.2 C31.2 C32.2 C33.2 C34.2 C35.2 C36.2 C37.2 C38.2 C39.2 C40.1 C41.1 C42.2 C43.2 C44.2 C45.2 IC1.A1(VSS) IC1.A19(VSS) IC1.A22(VSS) IC1.AA4(VSS) IC1.AA13(VSS_USBHS) IC1.AA16(VSS_USBHS) IC1.AA18(VSS) IC1.AB1(VSS) IC1.AB18(VSS) IC1.AB22(VSS) IC1.B2(VSS) IC1.B19(VSS) IC1.C3(VSS) IC1.C8(VSS) IC1.C11(VSS) IC1.C14(VSS_DSI) IC1.C15(VSS_DSI) IC1.C16(VSS_DSI) IC1.C17(VSS_DSI) IC1.C18(VSS_DSI) IC1.C19(VSS) IC1.C20(VSS) IC1.D4(VSS) IC1.D19(VSS_PLL_2) IC1.E5(VSS) IC1.E19(VSS) IC1.F6(VSS) IC1.F7(VSS) IC1.F8(VSS) IC1.F16(VSS) IC1.F20(VSS) IC1.G4(VSS) IC1.G6(VSS) IC1.G8(VSS) IC1.G10(VSS) IC1.G12(VSS) IC1.G14(VSS) IC1.G17(VSS) IC1.H7(VSS) IC1.J9(VSS) IC1.J11(VSS) IC1.J13(VSS) IC1.J17(VSS) IC1.J20(VSS) IC1.K3(VSS) IC1.K7(VSS) IC1.K10(VSS) IC1.K12(VSS) IC1.K14(VSS) IC1.L9(VSS) IC1.L11(VSS) IC1.L13(VSS) IC1.L17(VSS) IC1.L19(VSS) IC1.L20(VSS) IC1.M5(VSS_PLL) IC1.M7(VSS) IC1.M10(VSS) IC1.M12(VSS) IC1.M14(VSS) IC1.N6(VREF-) IC1.N9(VSS) IC1.N11(VSS) IC1.N13(VSS) IC1.N17(VSS) IC1.P3(VSS) IC1.P5(VSS_ANA) IC1.P7(VSS) IC1.P10(VSS) IC1.P12(VSS) IC1.P14(VSS) IC1.P20(VSS) IC1.R6(VSSA) IC1.R8(VSS) IC1.R17(VSS) IC1.T6(VSSA) IC1.T7(VSS) IC1.T9(VSS) IC1.T11(VSS) IC1.T19(VSS) IC1.U6(VSSA) IC1.U7(VSS) IC1.U13(VSS) IC1.U15(VSS) IC1.U17(VSS) IC1.U20(VSS) IC1.V5(VSS) IC1.V16(VSS) IC1.V18(VSS) IC1.V19(VSS) IC1.W17(VSS) IC1.W19(VSS) IC1.Y3(VSS) IC1.Y7(VSS) IC1.Y10(VSS) IC1.Y13(VSS_USBHS) IC1.Y14(VSS_USBHS) IC1.Y15(VSS_USBHS) IC1.Y18(VSS) IC1.Y20(VSS) IC3.6(PGND) IC3.10(PGND) IC3.15(GNDLDO) IC3.26(PGND) IC3.30(PGND) IC3.32(PGND) IC3.41(AGND) IC3.45(EP) J1.2 J1.3 ; also sheet 1,3
N$1: C2.1 IC1.R5(VDDA) L1.2
N$2: L1.1 R1.2
N$3: C3.2 IC1.AB17(VDDA_1V1_REG)
N$4: C5.2 IC1.A18(VDD_1V2_DSI_PHY) IC1.B18(VDD_1V2_DSI_REG)
N$5: IC3.33(VLXBST) R2.2
N$6: B1.B'(S1) B1.B(S) IC3.17(!PONKEY!)
N$7: IC3.37(SWIN) R3.2
N$8: C35.1 IC3.40(INTLDO)
N$9: IC3.25(VLX4) L2.1
N$10: IC3.29(VLX3) L3.1
N$11: IC3.11(VLX2) L4.1
N$12: C44.1 IC3.9(VOUT2) L4.2 SJ1.1
N$13: IC3.7(VLX1) L5.1
N$14: C45.1 IC3.5(VOUT1) L5.2 SJ2.1
PMIC_IRQ: IC3.43(!INT!)
PMIC_WAKEUP: IC3.2(WAKEUP)
POWER_ON: IC3.44(PWRCTRL)
SCL: IC3.4(SCL)
SDA: IC3.3(SDA)
VDD: C16.1 C17.1 C18.1 C19.1 C20.1 C21.1 C43.1 IC1.A14(VDD_DSI) IC1.D18(VDD_PLL) IC1.M6(VDD_PLL) IC1.M9(VDD) IC1.N5(VDD_ANA) IC1.N8(VDD) IC1.N10(VDD) IC1.P9(VDD) IC1.P11(VDD) IC1.R10(VDD) IC1.R12(VDD) IC1.T13(VDD) IC1.U9(VDD) IC1.U12(VDD) IC1.U14(VDD) IC3.31(VOUT3) IC3.42(VIO) L3.2 R1.1
VDD_CORE: C8.1 C9.1 C10.1 C11.1 C12.1 C13.1 C14.1 C15.1 IC1.H9(VDDCORE) IC1.H11(VDDCORE) IC1.H13(VDDCORE) IC1.H15(VDDCORE) IC1.J8(VDDCORE) IC1.J10(VDDCORE) IC1.J12(VDDCORE) IC1.J14(VDDCORE) IC1.K9(VDDCORE) IC1.K11(VDDCORE) IC1.K13(VDDCORE) IC1.K15(VDDCORE) IC1.L8(VDDCORE) IC1.L10(VDDCORE) IC1.L12(VDDCORE) IC1.L14(VDDCORE) IC1.M11(VDDCORE) IC1.M13(VDDCORE) IC1.M15(VDDCORE) IC1.N12(VDDCORE) IC1.N14(VDDCORE) IC1.P13(VDDCORE) IC1.P15(VDDCORE) IC1.R14(VDDCORE) IC1.T15(VDDCORE) SJ2.2
VDD_DDR: C22.1 C23.1 C24.1 C25.1 C30.1 IC1.E18(VDDQ_DDR) IC1.F17(VDDQ_DDR) IC1.G16(VDDQ_DDR) IC1.H17(VDDQ_DDR) IC1.J16(VDDQ_DDR) IC1.K17(VDDQ_DDR) IC1.L16(VDDQ_DDR) IC1.M17(VDDQ_DDR) IC1.N16(VDDQ_DDR) IC1.P17(VDDQ_DDR) IC1.R16(VDDQ_DDR) IC1.T17(VDDQ_DDR) IC1.U16(VDDQ_DDR) IC1.V17(VDDQ_DDR) IC1.W18(VDDQ_DDR) IC1.Y19(VDDQ_DDR) IC3.13(LDO3IN) SJ1.2 ; also sheet 3
VDD_USB: C4.1 C34.1 IC1.AB13(VDD_3V3__USBHS) IC1.AB16(VDD_3V3__USBFS) IC3.39(LDO4OUT)
VDDA: C36.1 IC3.20(LDO5OUT)
VDDA_1V8: C6.2 C7.2 IC1.AB12(VDDA_1V8_REG) IC1.B14(VDDA_1V8_DSI)
VREF+: C1.1 IC1.P6(VREF+)
VREF_DDR: C41.2 IC3.16(VREFDDR) ; also sheet 3
VTT_DDR: C40.2 IC3.14(LDO3OUT) ; also sheet 3
Unconnected: IC1.M4(VBAT) IC3.34(BSTOUT) IC3.35(VBUSOTG) IC3.38(SWOUT)

### Notes on the sheet
- These need to be connected up
- These need to be connected up
- Rank 0: not powered automatically
  Rank 1: turned on after T+7ms
  Rank 2: turned on after T+10ms
  Rank 3: turned on after T+13ms
  
  Notes
  -----
  VOUT2 needs to be set to 1.5v
  LDO3OUT needs to be set to 0.75v
- Default output voltages:
  
  Which   Voltage Rank
  LDO1    1.8v    0
  LDO2    1.8v    0
  LDO3    1.8v    0
  LDO4    3.3v    3
  LDO5    2.9v    2
  LDO6    1.0v    0
  
  REFDDR  0.55v   0
  BOOST   5.2v    n/a
  
  BUCK1   1.2v    2
  BUCK2   1.1v    0
  BUCK3   3.3v    1
  BUCK4   3.3v    2

## Library data of the parts
B1 = microbuilder:SWITCH_TACT_SMT: SMT Tact Switches 6x6mm - Digikey: P12940SCT-ND KMR2 (4.6x2.8mm) - Digikey: 401-1426-1-ND EVQ-PQHB55 - Light Touch, 160GF (4.5x4.5mm) - Digikey: P8090SCT-ND; USE: KMR231NG LFS
C1-C3 C5 C6 C8-C23 C31 C32 C41 = rcl:C-EU: CAPACITOR, European symbol; SPICEPREFIX: C; USE: GRM033R60J105MEA2D
C4 C7 C46-C59 C62-C73 = rcl:C-EU: CAPACITOR, European symbol; SPICEPREFIX: C; USE: GRM033R61A104ME15D
C24 C25 = rcl:C-EU: CAPACITOR, European symbol; SPICEPREFIX: C; USE: 0201B102K250CT
C26-C30 C40 C60 C61 = rcl:C-EU: CAPACITOR, European symbol; SPICEPREFIX: C; USE: GRM155R60G106ME44D
C33-C39 = rcl:C-EU: CAPACITOR, European symbol; SPICEPREFIX: C; USE: PMK063EBJ475MP-F
C42-C45 C74 C75 = rcl:C-EU: CAPACITOR, European symbol; SPICEPREFIX: C; USE: CL05A226MQ5N6J8
D7 = pinhead:PINHD-2X16: PIN HEADER
IC1 = samacsys:STM32MP157AAA3: STMICROELECTRONICS - STM32MP157AAA3 - MPU, 32BIT, CORTEX-A7/CORTEX-M4 , LFBGA Source: Datasheet <https://www.st.com/resource/en/datasheet/stm32mp157a.pdf>; DESCRIPTION: STMICROELECTRONICS - STM32MP157AAA3 - MPU, 32BIT, CORTEX-A7/CORTEX-M4 , LFBGA; HEIGHT: 1.27mm; MANUFACTURER_NAME: STMicroelectronics; MANUFACTURER_PART_NUMBER: STM32MP157AAA3; MOUSER_PART_NUMBER: 511-STM32MP157AAA3; MOUSER_PRICE-STOCK: https://www.mouser.com/Search/Refine.aspx?Keyword=511-STM32MP157AAA3
IC2 = samacsys:MT41K256M16TW-107_P: MICRON - MT41K256M16TW-107:P - SDRAM, 256M X 16BIT, 0 TO 95DEG C Source: Datasheet <https://www.micron.com/~/media/documents/products/data-sheet/dram/ddr3/4gb_ddr3l.pdf>; DESCRIPTION: MICRON - MT41K256M16TW-107:P - SDRAM, 256M X 16BIT, 0 TO 95DEG C; HEIGHT: 1.2mm; MANUFACTURER_NAME: Micron; MANUFACTURER_PART_NUMBER: MT41K256M16TW-107:P; MOUSER_PART_NUMBER: 340-265846-TRAY; MOUSER_PRICE-STOCK: https://www.mouser.com/Search/Refine.aspx?Keyword=340-265846-TRAY; USE: IS43TR16256B-125KBL
IC3 = samacsys:STPMIC1APQR: STMICROELECTRONICS - STPMIC1APQR - POWER MANAGEMENT IC, WFQFN-44 Source: Datasheet <https://www.st.com/resource/en/datasheet/stpmic1.pdf>; DESCRIPTION: STMICROELECTRONICS - STPMIC1APQR - POWER MANAGEMENT IC, WFQFN-44; HEIGHT: 0.8mm; MANUFACTURER_NAME: STMicroelectronics; MANUFACTURER_PART_NUMBER: STPMIC1APQR; MOUSER_PART_NUMBER: 511-STPMIC1APQR; MOUSER_PRICE-STOCK: https://www.mouser.com/Search/Refine.aspx?Keyword=511-STPMIC1APQR
J1 = con-jack:DCJ0202: DC POWER JACK Source: DCJ0202.pdf; OC_FARNELL: unknown; OC_NEWARK: unknown
L1 = samacsys:LQM18FN4R7M00D: Murata LQM18F Series 4700 nH +/-20% Ferrite Multilayer SMD Inductor, 0603 Case, SRF: 0.05GHz 80mA dc 780m Rdc Source: Datasheet <http://psearch.en.murata.com/inductor/product/LQM18FN4R7M00#.pdf>; DESCRIPTION: Murata LQM18F Series 4700 nH +/-20% Ferrite Multilayer SMD Inductor, 0603 Case, SRF: 0.05GHz 80mA dc 780m Rdc; HEIGHT: 0.9mm; MANUFACTURER_NAME: Murata Electronics; MANUFACTURER_PART_NUMBER: LQM18FN4R7M00D; MOUSER_PART_NUMBER: 81-LQM18FN4R7M00D; MOUSER_PRICE-STOCK: https://www.mouser.com/Search/Refine.aspx?Keyword=81-LQM18FN4R7M00D; RS_PART_NUMBER: 7867055P; RS_PRICE-STOCK: http://uk.rs-online.com/web/p/products/7867055P; USE: LQM18FN4R7M00D
L2-L5 = samacsys:DFE252012P-4R7M=P2: Toko DFE252012P Series Shielded Wire-wound SMD Inductor with a Powered Iron Core, 4.7 uH Wire-Wound 2.2A Idc Source: Datasheet <https://psearch.en.murata.com/inductor/product/DFE252012P-4R7M#.html>; DESCRIPTION: Toko DFE252012P Series Shielded Wire-wound SMD Inductor with a Powered Iron Core, 4.7 uH Wire-Wound 2.2A Idc; HEIGHT: 1.2mm; MANUFACTURER_NAME: Murata Electronics; MANUFACTURER_PART_NUMBER: DFE252012P-4R7M=P2; MOUSER_PART_NUMBER: 81-DFE252012P-4R7MP2; MOUSER_PRICE-STOCK: https://www.mouser.com/Search/Refine.aspx?Keyword=81-DFE252012P-4R7MP2; RS_PART_NUMBER: 1252420; RS_PRICE-STOCK: https://uk.rs-online.com/web/p/products/1252420; USE: DFE252012P-1R0M=P2
MISC = pinhead:PINHD-1X13: PIN HEADER
R1 = rcl:R-EU_: RESISTOR, European symbol; SPICEPREFIX: R; USE: P15979TR-ND
R2 = rcl:R-EU_: RESISTOR, European symbol; NOSTUFF: 1; SPICEPREFIX: R; USE: RMCF0201JT47K0
R3 = rcl:R-EU_: RESISTOR, European symbol; NOSTUFF: 1; SPICEPREFIX: R; USE: P15979TR-ND
R4 R5 = rcl:R-EU_: RESISTOR, European symbol; SPICEPREFIX: R; USE: RMCF0201FT240R
R6 R7 = rcl:R-EU_: RESISTOR, European symbol; SPICEPREFIX: R; USE: RMCF0201FT10K0
R8 = rcl:R-EU_: RESISTOR, European symbol; SPICEPREFIX: R; USE: PFR03S-101-FNH
R9-R32 = rcl:R-EU_: RESISTOR, European symbol; SPICEPREFIX: R; USE: RMCF0201JT56R0
SJ1 SJ2 = microbuilder:SOLDERJUMPER_CLOSED: Solder Jumper - Closed These solder jumpers are closed by default CLOSEDWIRE - 10 mil trace between pads that can be cut and resoldered later CLOSEDPERM - 63 mil trace between pads for a permanent connection (used to 'bridge' two signals, a shameless hack for Eagle). Can double as a test point as well (no cream layer)
TP1 = testpad:TP: Test pad
U1-U4 = microbuilder:TXB0108PWR: 8-Bit Bi-Directional Level Shifter 1.2V-3.6V (VCCA) to 1.65V-5.5V (VCCB) bi-directional level shifter with auto direction sensing. Max data rate - VCCA 1.8V: 20Mbps (50ns), VCCA 3.3V: 100Mbps (10ns) Digikey: 296-21527-1-ND
U$2 = sjg-con:MINI-SAS: Mini-SAS connector, right angle through hole Part 1888019-4 Digikey part A111092CT-ND

## Net classes
1 Power: width 0.305 mm, drill 0.203 mm, clearance 0.203 mm
2 DDR_DQ: width 0.178 mm
3 DDR_CK: width 0.229 mm, clearance 0.406 mm
4 DDR_CTRL: width 0.178 mm

## Board
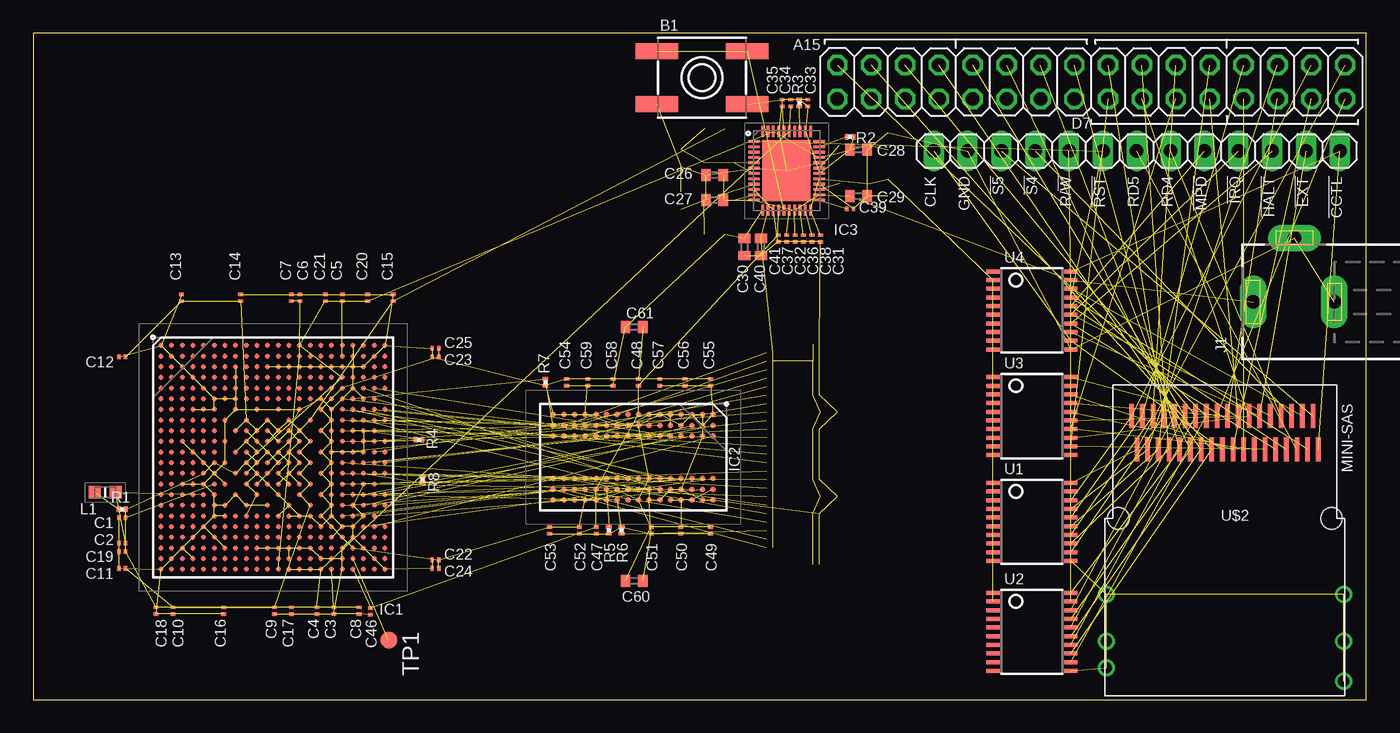
[diagram p6: board, top side]
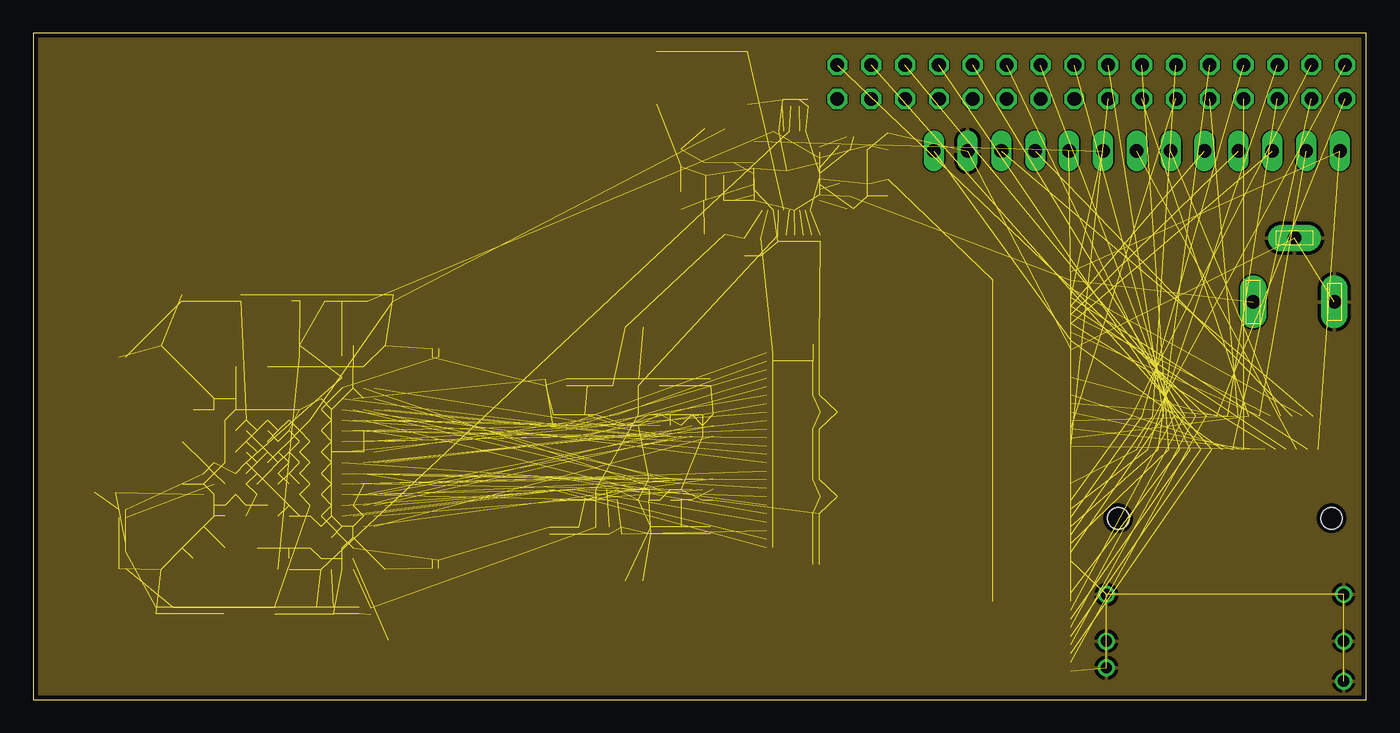
[diagram p7: board, inner layer Route2]
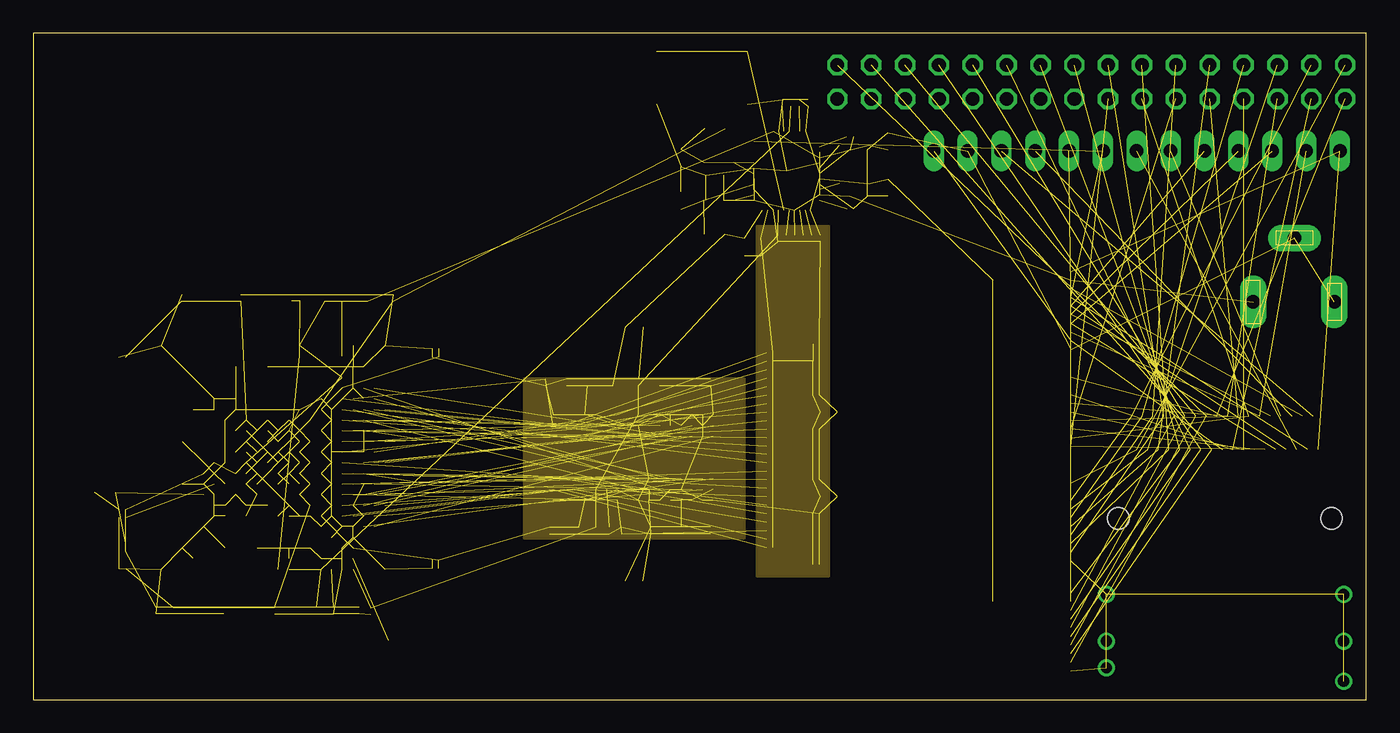
[diagram p8: board, inner layer Route15]
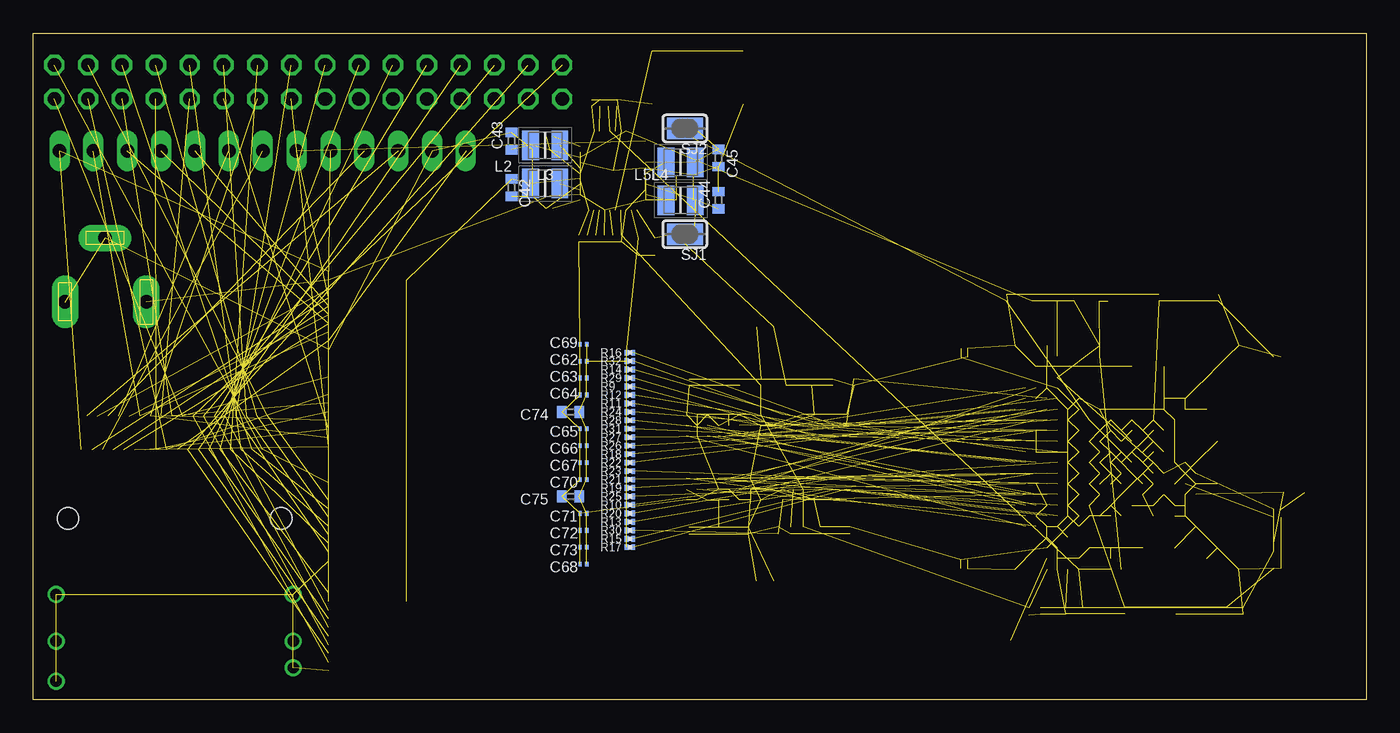
[diagram p9: board, bottom side, seen from below]

Size 100 x 50 mm. Coordinates in mm from the lower left corner, seen from the top.
Outline: 0,0 100,0 100,50 0,50 0,0
Copper layers (1+2*15+16): Top 0.035mm / dielectric 0.12mm / Route2 0.017mm / dielectric 1.2mm / Route15 0.017mm / dielectric 0.12mm / Bottom 0.035mm
Design rules "seed-6layer-4.4 *": minimum track width 4mil, minimum drill 0.2mm, track to track 4mil, track to pad 4mil, pad to pad 4mil, via to via 4mil, smd to smd 0mil, copper to edge 12mil, drill to drill 12mil, minimum pad ring 6mil, minimum via ring 5.5mil, stop-mask expansion 4mil, vias tented up to drill 25mil, thermal gap 10mil
vRestrict: area 66.7,36.7 to 98.4,39.8

### Footprints (pad centres in the part's own frame; a part is rotated, then mirrored left to right if it is on the bottom)
EVQ-Q2 = smd 3.2 x 1.2: A -3.4,-2; A' 3.4,-2; B -3.4,2; B' 3.4,2
C0201 = smd 0.25 x 0.35: 1 -0.25,0; 2 0.25,0
C0402 = smd 0.7 x 0.9: 1 -0.65,0; 2 0.65,0
2X16 = drill 1.016 octagon: 1 -19.05,-1.27; 2 -19.05,1.27; 3 -16.51,-1.27; 4 -16.51,1.27; 5 -13.97,-1.27; 6 -13.97,1.27; 7 -11.43,-1.27; 8 -11.43,1.27; 9 -8.89,-1.27; 10 -8.89,1.27; 11 -6.35,-1.27; 12 -6.35,1.27; 13 -3.81,-1.27; 14 -3.81,1.27; 15 -1.27,-1.27; 16 -1.27,1.27; 17 1.27,-1.27; 18 1.27,1.27; 19 3.81,-1.27; 20 3.81,1.27; 21 6.35,-1.27; 22 6.35,1.27; 23 8.89,-1.27; 24 8.89,1.27; 25 11.43,-1.27; 26 11.43,1.27; 27 13.97,-1.27; 28 13.97,1.27; 29 16.51,-1.27; 30 16.51,1.27; 31 19.05,-1.27; 32 19.05,1.27
BGA448C80P22X22_1800X1800X127 = smd 0.37 x 0.37: A1 -8.4,8.4; A2 -7.6,8.4; A3 -6.8,8.4; A4 -6,8.4; A5 -5.2,8.4; A6 -4.4,8.4; A7 -3.6,8.4; A8 -2.8,8.4; A9 -2,8.4; A10 -1.2,8.4; A11 -0.4,8.4; A12 0.4,8.4; A13 1.2,8.4; A14 2,8.4; A15 2.8,8.4; A16 3.6,8.4; A17 4.4,8.4; A18 5.2,8.4; A19 6,8.4; A20 6.8,8.4; A21 7.6,8.4; A22 8.4,8.4; AA1 -8.4,-7.6; AA2 -7.6,-7.6; AA3 -6.8,-7.6; AA4 -6,-7.6; AA5 -5.2,-7.6; AA6 -4.4,-7.6; AA7 -3.6,-7.6; AA8 -2.8,-7.6; AA9 -2,-7.6; AA10 -1.2,-7.6; AA11 -0.4,-7.6; AA12 0.4,-7.6; AA13 1.2,-7.6; AA14 2,-7.6; AA15 2.8,-7.6; AA16 3.6,-7.6; AA17 4.4,-7.6; AA18 5.2,-7.6; AA19 6,-7.6; AA20 6.8,-7.6; AA21 7.6,-7.6; AA22 8.4,-7.6; AB1 -8.4,-8.4; AB2 -7.6,-8.4; AB3 -6.8,-8.4; AB4 -6,-8.4; AB5 -5.2,-8.4; AB6 -4.4,-8.4; AB7 -3.6,-8.4; AB8 -2.8,-8.4; AB9 -2,-8.4; AB10 -1.2,-8.4; AB11 -0.4,-8.4; AB12 0.4,-8.4; AB13 1.2,-8.4; AB14 2,-8.4; AB15 2.8,-8.4; AB16 3.6,-8.4; AB17 4.4,-8.4; AB18 5.2,-8.4; AB19 6,-8.4; AB20 6.8,-8.4; AB21 7.6,-8.4; AB22 8.4,-8.4; B1 -8.4,7.6; B2 -7.6,7.6; B3 -6.8,7.6; B4 -6,7.6; B5 -5.2,7.6; B6 -4.4,7.6; B7 -3.6,7.6; B8 -2.8,7.6; B9 -2,7.6; B10 -1.2,7.6; B11 -0.4,7.6; B12 0.4,7.6; B13 1.2,7.6; B14 2,7.6; B15 2.8,7.6; B16 3.6,7.6; B17 4.4,7.6; B18 5.2,7.6; B19 6,7.6; B20 6.8,7.6; B21 7.6,7.6; B22 8.4,7.6; C1 -8.4,6.8; C2 -7.6,6.8; C3 -6.8,6.8; C4 -6,6.8; C5 -5.2,6.8; C6 -4.4,6.8; C7 -3.6,6.8; C8 -2.8,6.8; C9 -2,6.8; C10 -1.2,6.8; C11 -0.4,6.8; C12 0.4,6.8; C13 1.2,6.8; C14 2,6.8; C15 2.8,6.8; C16 3.6,6.8; C17 4.4,6.8; C18 5.2,6.8; C19 6,6.8; C20 6.8,6.8; C21 7.6,6.8; C22 8.4,6.8; D1 -8.4,6; D2 -7.6,6; D3 -6.8,6; D4 -6,6; D5 -5.2,6; D6 -4.4,6; D7 -3.6,6; D8 -2.8,6; D9 -2,6; D10 -1.2,6; D11 -0.4,6; D12 0.4,6; D13 1.2,6; D14 2,6; D15 2.8,6; D16 3.6,6; D17 4.4,6; D18 5.2,6; D19 6,6; D20 6.8,6; D21 7.6,6; D22 8.4,6; E1 -8.4,5.2; E2 -7.6,5.2; E3 -6.8,5.2; E4 -6,5.2; E5 -5.2,5.2; E6 -4.4,5.2; E7 -3.6,5.2; E8 -2.8,5.2; E9 -2,5.2; E10 -1.2,5.2; E11 -0.4,5.2; E12 0.4,5.2; E13 1.2,5.2; E14 2,5.2; E15 2.8,5.2; E16 3.6,5.2; E17 4.4,5.2; E18 5.2,5.2; E19 6,5.2; E20 6.8,5.2; E21 7.6,5.2; E22 8.4,5.2; F1 -8.4,4.4; F2 -7.6,4.4; F3 -6.8,4.4; F4 -6,4.4; F5 -5.2,4.4; F6 -4.4,4.4; F7 -3.6,4.4; F8 -2.8,4.4; F9 -2,4.4; F10 -1.2,4.4; F11 -0.4,4.4; F12 0.4,4.4; F13 1.2,4.4; F14 2,4.4; F15 2.8,4.4; F16 3.6,4.4; F17 4.4,4.4; F18 5.2,4.4; F19 6,4.4; F20 6.8,4.4; F21 7.6,4.4; G1 -8.4,3.6; G2 -7.6,3.6; G3 -6.8,3.6; G4 -6,3.6; G5 -5.2,3.6; G6 -4.4,3.6; G8 -2.8,3.6; G10 -1.2,3.6; G12 0.4,3.6; G14 2,3.6; G16 3.6,3.6; G17 4.4,3.6; G18 5.2,3.6; G19 6,3.6; G20 6.8,3.6; G21 7.6,3.6; G22 8.4,3.6; H1 -8.4,2.8; H2 -7.6,2.8; H3 -6.8,2.8; H4 -6,2.8; H5 -5.2,2.8; H6 -4.4,2.8; H7 -3.6,2.8; H9 -2,2.8; H11 -0.4,2.8; H13 1.2,2.8; H15 2.8,2.8; H17 4.4,2.8; H18 5.2,2.8; H19 6,2.8; H20 6.8,2.8; H21 7.6,2.8; H22 8.4,2.8; J1 -8.4,2; J2 -7.6,2; J3 -6.8,2; J4 -6,2; J5 -5.2,2; J6 -4.4,2; J8 -2.8,2; J9 -2,2; J10 -1.2,2; J11 -0.4,2; J12 0.4,2; J13 1.2,2; J14 2,2; J16 3.6,2; J17 4.4,2; J18 5.2,2; J19 6,2; J20 6.8,2; J21 7.6,2; K1 -8.4,1.2; K2 -7.6,1.2; K3 -6.8,1.2; K4 -6,1.2; K5 -5.2,1.2; K6 -4.4,1.2; K7 -3.6,1.2; K9 -2,1.2; K10 -1.2,1.2; K11 -0.4,1.2; K12 0.4,1.2; K13 1.2,1.2; K14 2,1.2; K15 2.8,1.2; K17 4.4,1.2; K18 5.2,1.2; K19 6,1.2; K20 6.8,1.2; K21 7.6,1.2; K22 8.4,1.2; L1 -8.4,0.4; L2 -7.6,0.4; L3 -6.8,0.4; L4 -6,0.4; L5 -5.2,0.4; L6 -4.4,0.4; L8 -2.8,0.4; L9 -2,0.4; L10 -1.2,0.4; L11 -0.4,0.4; L12 0.4,0.4; L13 1.2,0.4; L14 2,0.4; L16 3.6,0.4; L17 4.4,0.4; L18 5.2,0.4; L19 6,0.4; L20 6.8,0.4; L21 7.6,0.4; L22 8.4,0.4; M1 -8.4,-0.4; M2 -7.6,-0.4; M3 -6.8,-0.4; M4 -6,-0.4; M5 -5.2,-0.4; M6 -4.4,-0.4; M7 -3.6,-0.4; M9 -2,-0.4; M10 -1.2,-0.4; M11 -0.4,-0.4; M12 0.4,-0.4; M13 1.2,-0.4; M14 2,-0.4; M15 2.8,-0.4; M17 4.4,-0.4; M18 5.2,-0.4; M19 6,-0.4; M20 6.8,-0.4; M21 7.6,-0.4; M22 8.4,-0.4; N1 -8.4,-1.2; N2 -7.6,-1.2; N3 -6.8,-1.2; N4 -6,-1.2; N5 -5.2,-1.2; N6 -4.4,-1.2; N8 -2.8,-1.2; N9 -2,-1.2; N10 -1.2,-1.2; N11 -0.4,-1.2; N12 0.4,-1.2; N13 1.2,-1.2; N14 2,-1.2; N16 3.6,-1.2; N17 4.4,-1.2; N18 5.2,-1.2; N19 6,-1.2; N20 6.8,-1.2; N21 7.6,-1.2; N22 8.4,-1.2; P1 -8.4,-2; P2 -7.6,-2; P3 -6.8,-2; P4 -6,-2; P5 -5.2,-2; P6 -4.4,-2; P7 -3.6,-2; P9 -2,-2; P10 -1.2,-2; P11 -0.4,-2; P12 0.4,-2; P13 1.2,-2; P14 2,-2; P15 2.8,-2; P17 4.4,-2; P18 5.2,-2; P19 6,-2; P20 6.8,-2; P21 7.6,-2; R1 -8.4,-2.8; R2 -7.6,-2.8; R3 -6.8,-2.8; R4 -6,-2.8; R5 -5.2,-2.8; R6 -4.4,-2.8; R8 -2.8,-2.8; R10 -1.2,-2.8; R12 0.4,-2.8; R14 2,-2.8; R16 3.6,-2.8; R17 4.4,-2.8; R18 5.2,-2.8; R19 6,-2.8; R20 6.8,-2.8; R21 7.6,-2.8; R22 8.4,-2.8; T1 -8.4,-3.6; T2 -7.6,-3.6; T3 -6.8,-3.6; T4 -6,-3.6; T5 -5.2,-3.6; T6 -4.4,-3.6; T7 -3.6,-3.6; T9 -2,-3.6; T11 -0.4,-3.6; T13 1.2,-3.6; T15 2.8,-3.6; T17 4.4,-3.6; T18 5.2,-3.6; T19 6,-3.6; T20 6.8,-3.6; T21 7.6,-3.6; T22 8.4,-3.6; U1 -8.4,-4.4; U2 -7.6,-4.4; U3 -6.8,-4.4; U4 -6,-4.4; U5 -5.2,-4.4; U6 -4.4,-4.4; U7 -3.6,-4.4; U8 -2.8,-4.4; U9 -2,-4.4; U10 -1.2,-4.4; U11 -0.4,-4.4; U12 0.4,-4.4; U13 1.2,-4.4; U14 2,-4.4; U15 2.8,-4.4; U16 3.6,-4.4; U17 4.4,-4.4; U18 5.2,-4.4; U19 6,-4.4; U20 6.8,-4.4; U21 7.6,-4.4; V1 -8.4,-5.2; V2 -7.6,-5.2; V3 -6.8,-5.2; V4 -6,-5.2; V5 -5.2,-5.2; V6 -4.4,-5.2; V7 -3.6,-5.2; V8 -2.8,-5.2; V9 -2,-5.2; V10 -1.2,-5.2; V11 -0.4,-5.2; V12 0.4,-5.2; V13 1.2,-5.2; V14 2,-5.2; V15 2.8,-5.2; V16 3.6,-5.2; V17 4.4,-5.2; V18 5.2,-5.2; V19 6,-5.2; V20 6.8,-5.2; V21 7.6,-5.2; V22 8.4,-5.2; W1 -8.4,-6; W2 -7.6,-6; W3 -6.8,-6; W4 -6,-6; W5 -5.2,-6; W6 -4.4,-6; W7 -3.6,-6; W8 -2.8,-6; W9 -2,-6; W10 -1.2,-6; W11 -0.4,-6; W12 0.4,-6; W13 1.2,-6; W14 2,-6; W15 2.8,-6; W16 3.6,-6; W17 4.4,-6; W18 5.2,-6; W19 6,-6; W20 6.8,-6; W21 7.6,-6; W22 8.4,-6; Y1 -8.4,-6.8; Y2 -7.6,-6.8; Y3 -6.8,-6.8; Y4 -6,-6.8; Y5 -5.2,-6.8; Y6 -4.4,-6.8; Y7 -3.6,-6.8; Y8 -2.8,-6.8; Y9 -2,-6.8; Y10 -1.2,-6.8; Y11 -0.4,-6.8; Y12 0.4,-6.8; Y13 1.2,-6.8; Y14 2,-6.8; Y15 2.8,-6.8; Y16 3.6,-6.8; Y17 4.4,-6.8; Y18 5.2,-6.8; Y19 6,-6.8; Y20 6.8,-6.8; Y21 7.6,-6.8; Y22 8.4,-6.8
BGA96C80P9X16_800X1400X120 = smd 0.426 x 0.426: A1 -3.2,6; A2 -2.4,6; A3 -1.6,6; A7 1.6,6; A8 2.4,6; A9 3.2,6; B1 -3.2,5.2; B2 -2.4,5.2; B3 -1.6,5.2; B7 1.6,5.2; B8 2.4,5.2; B9 3.2,5.2; C1 -3.2,4.4; C2 -2.4,4.4; C3 -1.6,4.4; C7 1.6,4.4; C8 2.4,4.4; C9 3.2,4.4; D1 -3.2,3.6; D2 -2.4,3.6; D3 -1.6,3.6; D7 1.6,3.6; D8 2.4,3.6; D9 3.2,3.6; E1 -3.2,2.8; E2 -2.4,2.8; E3 -1.6,2.8; E7 1.6,2.8; E8 2.4,2.8; E9 3.2,2.8; F1 -3.2,2; F2 -2.4,2; F3 -1.6,2; F7 1.6,2; F8 2.4,2; F9 3.2,2; G1 -3.2,1.2; G2 -2.4,1.2; G3 -1.6,1.2; G7 1.6,1.2; G8 2.4,1.2; G9 3.2,1.2; H1 -3.2,0.4; H2 -2.4,0.4; H3 -1.6,0.4; H7 1.6,0.4; H8 2.4,0.4; H9 3.2,0.4; J1 -3.2,-0.4; J2 -2.4,-0.4; J3 -1.6,-0.4; J7 1.6,-0.4; J8 2.4,-0.4; J9 3.2,-0.4; K1 -3.2,-1.2; K2 -2.4,-1.2; K3 -1.6,-1.2; K7 1.6,-1.2; K8 2.4,-1.2; K9 3.2,-1.2; L1 -3.2,-2; L2 -2.4,-2; L3 -1.6,-2; L7 1.6,-2; L8 2.4,-2; L9 3.2,-2; M1 -3.2,-2.8; M2 -2.4,-2.8; M3 -1.6,-2.8; M7 1.6,-2.8; M8 2.4,-2.8; M9 3.2,-2.8; N1 -3.2,-3.6; N2 -2.4,-3.6; N3 -1.6,-3.6; N7 1.6,-3.6; N8 2.4,-3.6; N9 3.2,-3.6; P1 -3.2,-4.4; P2 -2.4,-4.4; P3 -1.6,-4.4; P7 1.6,-4.4; P8 2.4,-4.4; P9 3.2,-4.4; R1 -3.2,-5.2; R2 -2.4,-5.2; R3 -1.6,-5.2; R7 1.6,-5.2; R8 2.4,-5.2; R9 3.2,-5.2; T1 -3.2,-6; T2 -2.4,-6; T3 -1.6,-6; T7 1.6,-6; T8 2.4,-6; T9 3.2,-6
QFN40P500X600X80-45N = smd 0.85 x 0.2: 1 -2.45,2.2; 2 -2.45,1.8; 3 -2.45,1.4; 4 -2.45,1; 5 -2.45,0.6; 6 -2.45,0.2; 7 -2.45,-0.2; 8 -2.45,-0.6; 9 -2.45,-1; 10 -2.45,-1.4; 11 -2.45,-1.8; 12 -2.45,-2.2; 23 2.45,-2.2; 24 2.45,-1.8; 25 2.45,-1.4; 26 2.45,-1; 27 2.45,-0.6; 28 2.45,-0.2; 29 2.45,0.2; 30 2.45,0.6; 31 2.45,1; 32 2.45,1.4; 33 2.45,1.8; 34 2.45,2.2 | smd 0.2 x 0.85: 13 -1.8,-2.95; 14 -1.4,-2.95; 15 -1,-2.95; 16 -0.6,-2.95; 17 -0.2,-2.95; 18 0.2,-2.95; 19 0.6,-2.95; 20 1,-2.95; 21 1.4,-2.95; 22 1.8,-2.95; 35 1.8,2.95; 36 1.4,2.95; 37 1,2.95; 38 0.6,2.95; 39 0.2,2.95; 40 -0.2,2.95; 41 -0.6,2.95; 42 -1,2.95; 43 -1.4,2.95; 44 -1.8,2.95 | smd 3.6 x 4.6: 45 0,0
DCJ0202 = drill 1 pad 2 long: 1 0,3.1; 2 4.8,0; 3 0,-3
INDC1608X90N = smd 0.9 x 0.95: 1 -0.8,0; 2 0.8,0
INDC2520X120N = smd 1.25 x 2.2: 1 -1.1,0; 2 1.1,0
1X13 = drill 1.016 long: 1 -15.24,0; 2 -12.7,0; 3 -10.16,0; 4 -7.62,0; 5 -5.08,0; 6 -2.54,0; 7 0,0; 8 2.54,0; 9 5.08,0; 10 7.62,0; 11 10.16,0; 12 12.7,0; 13 15.24,0
R0201 = smd 0.28 x 0.43: 1 -0.255,0; 2 0.255,0
SOLDERJUMPER_CLOSEDPERM = smd 1.168 x 1.6: 1 -0.762,0; 2 0.762,0 | smd 0.635 x 1.6: WIRE 0,0
B1,27 = smd 1.27 x 1.27: TP 0,0
TSSOP20 = smd 0.305 x 0.991: 1 -2.925,-2.918; 2 -2.275,-2.918; 3 -1.625,-2.918; 4 -0.975,-2.918; 5 -0.325,-2.918; 6 0.325,-2.918; 7 0.975,-2.918; 8 1.625,-2.918; 9 2.275,-2.918; 10 2.925,-2.918; 11 2.925,2.918; 12 2.275,2.918; 13 1.625,2.918; 14 0.975,2.918; 15 0.325,2.918; 16 -0.325,2.918; 17 -0.975,2.918; 18 -1.625,2.918; 19 -2.275,2.918; 20 -2.925,2.918
MINI-SAS = smd 0.35 x 1.8: PA1 -6.2,8.78; PA2 -5.4,8.78; PA3 -4.6,8.78; PA4 -3.8,8.78; PA5 -3,8.78; PA6 -2.2,8.78; PA7 -1.4,8.78; PA8 -0.6,8.78; PA9 0.2,8.78; PA10 1,8.78; PA11 1.8,8.78; PA12 2.6,8.78; PA13 3.4,8.78; PA14 4.2,8.78; PA15 5,8.78; PA16 5.8,8.78; PA17 6.6,8.78; PA18 7.4,8.78; PB1 -6.6,11.29; PB2 -5.8,11.29; PB3 -5,11.29; PB4 -4.2,11.29; PB5 -3.4,11.29; PB6 -2.6,11.29; PB7 -1.8,11.29; PB8 -1,11.29; PB9 -0.2,11.29; PB10 0.6,11.29; PB11 1.4,11.29; PB12 2.2,11.29; PB13 3,11.29; PB14 3.8,11.29; PB15 4.6,11.29; PB16 5.4,11.29; PB17 6.2,11.29; PB18 7,11.29 | drill 0.85: SHIELD1 -8.5,-2.12; SHIELD2 -8.5,-5.62; SHIELD3 -8.5,-7.62; SHIELD4 9.3,-2.12; SHIELD5 9.3,-5.62; SHIELD6 9.3,-8.62 | hole 1.6: -7.6,3.6; 8.4,3.6

### Placement (x,y rotation side)
B1  50.16,46.67 0 top
C1  6.67,13.65 180 top
C2  6.67,11.75 180 top
C3  22.54,6.67 90 top
C4  21.27,6.67 270 top
C5  23.18,30.16 270 top
C6  20,30.16 270 top
C7  19.37,30.16 270 top
C8  24.45,6.67 270 top
C9  18.1,6.67 270 top
C10  10.48,6.67 270 top
C11  6.67,9.84 180 top
C12  6.67,25.72 180 top
C13  11.11,30.16 90 top
C14  15.56,30.16 90 top
C15  26.99,30.16 90 top
C16  14.29,6.67 270 top
C17  19.37,6.67 270 top
C18  9.21,6.67 270 top
C19  6.67,11.11 180 top
C20  25.08,30.16 90 top
C21  21.91,30.16 90 top
C22  30.16,10.48 180 top
C23  30.16,25.72 180 top
C24  30.16,9.84 180 top
C25  30.16,26.35 180 top
C26  51.12,39.37 0 top
C27  51.12,37.47 0 top
C28  61.91,41.27 180 top
C29  61.91,37.78 180 top
C30  53.34,33.97 270 top
C31  59.05,34.61 270 top
C32  57.15,34.61 270 top
C33  58.1,44.77 90 top
C34  56.83,44.77 90 top
C35  56.2,44.77 90 top
C36  57.78,34.61 270 top
C37  56.52,34.61 270 top
C38  58.42,34.61 270 top
C39  61.28,36.83 0 top
C40  54.61,33.97 90 top
C41  55.88,34.61 90 top
C42  64.14,38.42 270 bottom
C43  64.14,41.91 90 bottom
C44  48.58,37.47 90 bottom
C45  48.58,40.64 270 bottom
C46  25.29,6.62 270 top
C47  42.23,12.7 90 top
C48  45.4,23.81 270 top
C49  50.8,12.7 90 top
C50  48.58,12.7 90 top
C51  46.35,12.7 90 top
C52  40.96,12.7 90 top
C53  38.73,12.7 90 top
C54  40.01,23.81 270 top
C55  50.8,23.81 270 top
C56  48.9,23.81 270 top
C57  46.99,23.81 270 top
C58  43.5,23.81 270 top
C59  41.59,23.81 270 top
C60  45.09,8.89 0 top
C61  45.09,27.94 0 top
C62  58.74,25.4 0 bottom
C63  58.74,24.13 0 bottom
C64  58.74,22.86 0 bottom
C65  58.74,20.32 0 bottom
C66  58.74,19.05 0 bottom
C67  58.74,17.78 0 bottom
C68  58.74,10.16 0 bottom
C69  58.74,26.67 0 bottom
C70  58.74,16.51 0 bottom
C71  58.74,13.97 0 bottom
C72  58.74,12.7 0 bottom
C73  58.74,11.43 0 bottom
C74  59.69,21.59 0 bottom
C75  59.69,15.24 0 bottom
D7  79.38,46.35 180 top
IC1  17.98,18.18 0 top
IC2  45.01,18.18 270 top
IC3  56.52,39.69 0 top
J1  94.61,29.84 90 top
L1  5.4,15.56 0 top
L2  61.59,38.73 180 bottom
L3  61.59,41.59 180 bottom
L4  51.44,37.47 0 bottom
L5  51.44,40.32 0 bottom
MISC  82.79,41.17 180 top
R1  6.67,14.29 180 top
R2  61.28,42.23 180 top
R3  57.47,44.77 270 top
R4  28.94,19.5 0 top
R5  43.18,12.7 270 top
R6  44.13,12.7 270 top
R7  38.42,23.81 90 top
R8  29.21,16.51 90 top
R9  55.24,23.5 180 bottom
R10  55.24,14.61 180 bottom
R11  55.24,22.23 180 bottom
R12  55.24,22.86 180 bottom
R13  55.24,13.34 180 bottom
R14  55.24,24.77 180 bottom
R15  55.24,12.06 180 bottom
R16  55.24,26.04 180 bottom
R17  55.24,11.43 180 bottom
R18  55.24,18.41 180 bottom
R19  55.24,15.88 180 bottom
R20  55.24,13.97 180 bottom
R21  55.24,16.51 180 bottom
R22  55.24,17.78 180 bottom
R23  55.24,17.14 180 bottom
R24  55.24,21.59 180 bottom
R25  55.24,15.24 180 bottom
R26  55.24,19.05 180 bottom
R27  55.24,19.68 180 bottom
R28  55.24,20.95 180 bottom
R29  55.24,24.13 180 bottom
R30  55.24,12.7 180 bottom
R31  55.24,20.32 180 bottom
R32  55.24,25.4 180 bottom
SJ1  51.12,34.92 180 bottom
SJ2  51.12,42.86 180 bottom
TP1  26.67,4.45 270 top
U1  74.93,13.34 270 top
U2  74.93,5.08 270 top
U3  74.93,21.27 270 top
U4  74.93,29.21 270 top
U$2  89,10 0 top

### Tracks (layer width: path | path; a pad name or v marks a point on that pad's centre or on a via)
1V2_HDMI  (1 unrouted)
1V8_AUDIO  (1 unrouted)
3.3V  (8 unrouted)
3V3_HDMI  (1 unrouted)
!CCTL!  (2 unrouted)
!DDR_CAS!  (2 unrouted)
!DDR_CS!  (2 unrouted)
!DDR_RAS!  (2 unrouted)
!DDR_RESET!  (2 unrouted)
!DDR_WE!  (2 unrouted)
!EXTSEL!  (2 unrouted)
!HALT!  (2 unrouted)
!IRQ!  (2 unrouted)
!MPD!  (2 unrouted)
!RST!  (3 unrouted)
!S4!  (1 unrouted)
!S5!  (1 unrouted)
+5V  (18 unrouted)
A0  (2 unrouted)
A1  (2 unrouted)
A2  (2 unrouted)
A3  (2 unrouted)
A4  (2 unrouted)
A5  (2 unrouted)
A6  (2 unrouted)
A7  (2 unrouted)
A8  (2 unrouted)
A9  (2 unrouted)
A10  (2 unrouted)
A11  (2 unrouted)
A12  (2 unrouted)
A13  (2 unrouted)
A14  (2 unrouted)
A15  (2 unrouted)
CLK  (2 unrouted)
D0  (2 unrouted)
D1  (2 unrouted)
D2  (2 unrouted)
D3  (2 unrouted)
D4  (2 unrouted)
D5  (2 unrouted)
D6  (2 unrouted)
D7  (2 unrouted)
DDR_A0  (2 unrouted)
DDR_A1  (2 unrouted)
DDR_A2  (2 unrouted)
DDR_A3  (2 unrouted)
DDR_A4  (2 unrouted)
DDR_A5  (2 unrouted)
DDR_A6  (2 unrouted)
DDR_A7  (2 unrouted)
DDR_A8  (2 unrouted)
DDR_A9  (2 unrouted)
DDR_A10  (2 unrouted)
DDR_A11  (2 unrouted)
DDR_A12  (2 unrouted)
DDR_A13  (2 unrouted)
DDR_A14  (2 unrouted)
DDR_BA0  (2 unrouted)
DDR_BA1  (2 unrouted)
DDR_BA2  (2 unrouted)
DDR_CK_N  (2 unrouted)
DDR_CK_P  (2 unrouted)
DDR_CKE  (3 unrouted)
DDR_DQ0  (1 unrouted)
DDR_DQ1  (1 unrouted)
DDR_DQ2  (1 unrouted)
DDR_DQ3  (1 unrouted)
DDR_DQ4  (1 unrouted)
DDR_DQ5  (1 unrouted)
DDR_DQ6  (1 unrouted)
DDR_DQ7  (1 unrouted)
DDR_DQ8  (1 unrouted)
DDR_DQ9  (1 unrouted)
DDR_DQ10  (1 unrouted)
DDR_DQ11  (1 unrouted)
DDR_DQ12  (1 unrouted)
DDR_DQ13  (1 unrouted)
DDR_DQ14  (1 unrouted)
DDR_DQ15  (1 unrouted)
DDR_LDM  (1 unrouted)
DDR_LQDM_N  (1 unrouted)
DDR_LQDM_P  (1 unrouted)
DDR_ODT  (2 unrouted)
DDR_UDM  (1 unrouted)
DDR_UQDM_N  (1 unrouted)
DDR_UQDM_P  (1 unrouted)
GND  (222 unrouted)
  pour Route2: -1,51 101,51 101,-1 -1,-1
N$1  (2 unrouted)
N$2  (1 unrouted)
N$3  (1 unrouted)
N$4  (2 unrouted)
N$5  (1 unrouted)
N$6  (2 unrouted)
N$7  (1 unrouted)
N$8  (1 unrouted)
N$9  (1 unrouted)
N$10  (1 unrouted)
N$11  (1 unrouted)
N$12  (3 unrouted)
N$13  (1 unrouted)
N$14  (3 unrouted)
N$15  (1 unrouted)
N$16  (1 unrouted)
N$17  (1 unrouted)
R/!W!  (2 unrouted)
RD4  (1 unrouted)
RD5  (1 unrouted)
VDD  (25 unrouted)
VDD_CORE  (33 unrouted)
VDD_DDR  (53 unrouted)
  pour Route15: 53.34,24.13 53.34,12.06 36.83,12.06 36.83,24.13
VDD_USB  (4 unrouted)
VDDA  (1 unrouted)
VDDA_1V8  (3 unrouted)
VREF+  (1 unrouted)
VREF_DDR  (7 unrouted)
VTT_DDR  (39 unrouted)
  pour Route15: 54.29,35.56 59.69,35.56 59.69,9.21 54.29,9.21

### Text on the board
tPlace: A15 | CLK | GND | !S5! | !S4! | R/!W! | !RST! | RD5 | RD4 | !MPD! | !IRQ! | !HALT! | !EXT! | !CCTL!